# EAGLE design MJ514 - rev.1 - prod (EAGLE 9.6.2)
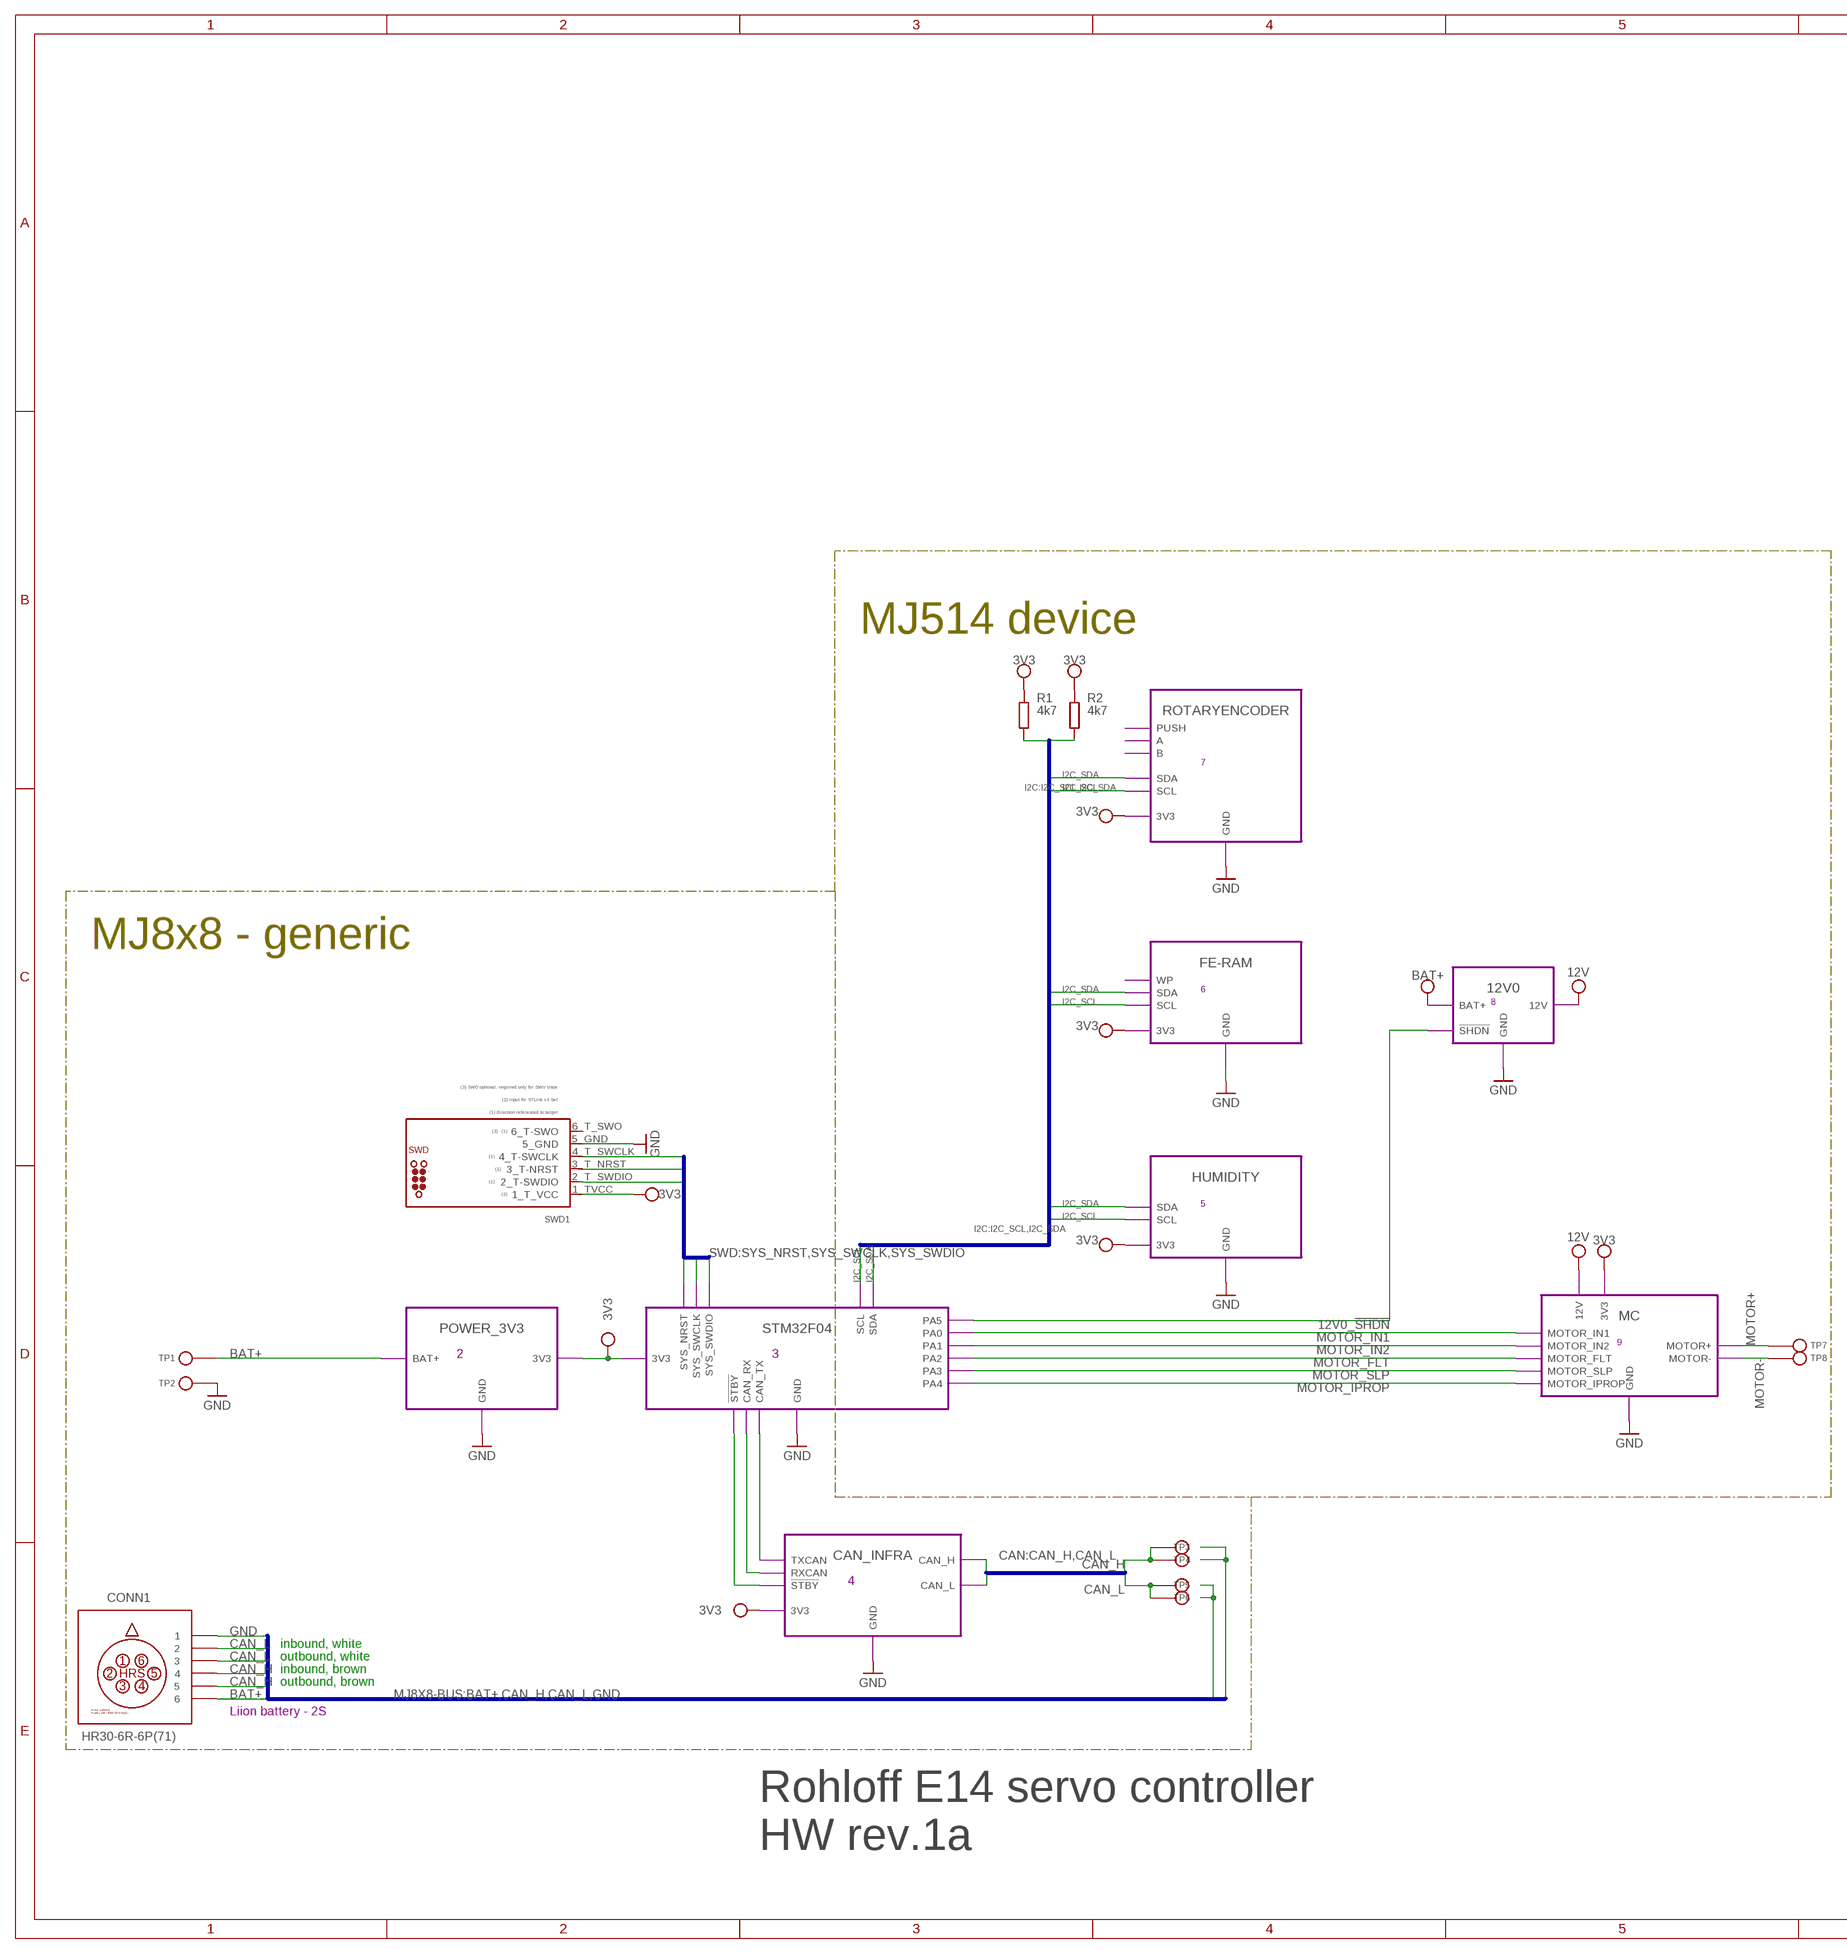
[diagram p0: schematic, sheet 1, part 1 of 2]
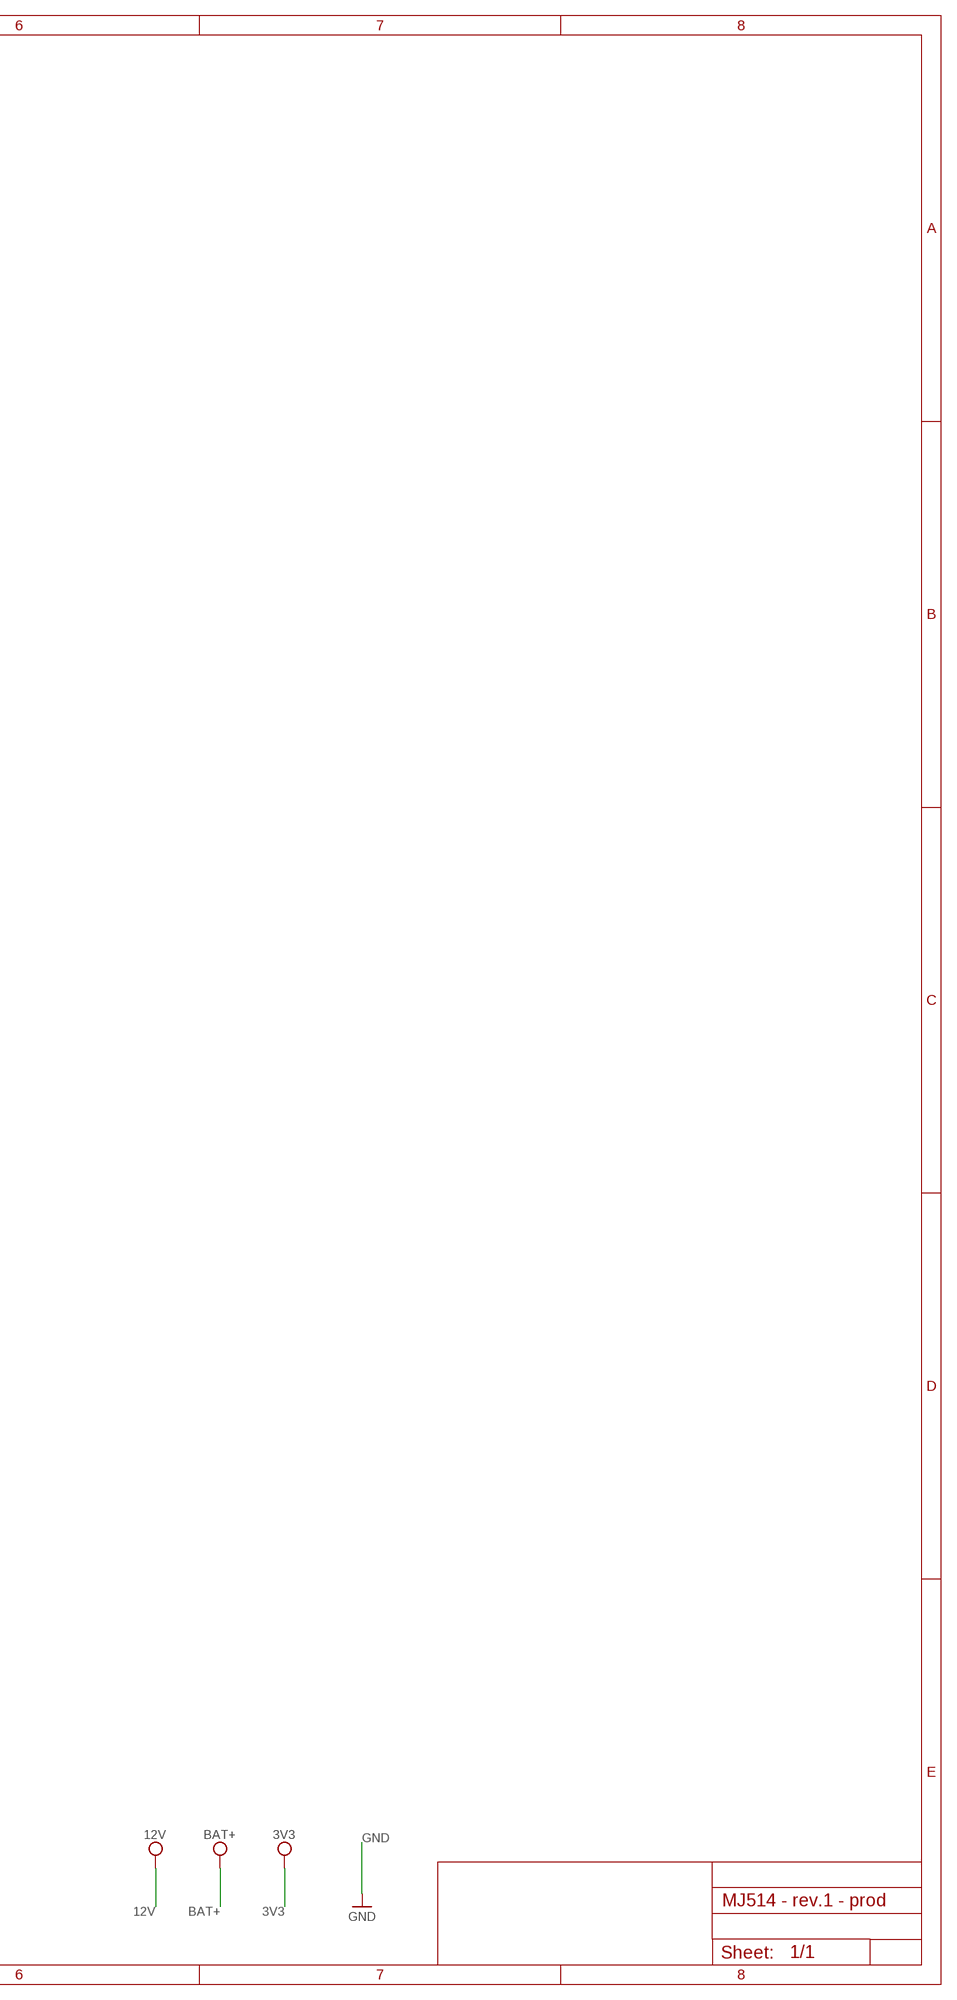
[diagram p1: schematic, sheet 1, part 2 of 2]

## Parts
CONN1  HR30-6R-6P(71)  HR-30-6R-6X  (no package)
R1  4k7  R-EU_R0402  [R0402]
R2  4k7  R-EU_R0402  [R0402]
SWD1  TC2030  [TC2030-NL]
TP1  LiIon + Terminal  TPTH-0.9  [TH-0.9]
TP2  LiIon - Terminal  TPTH-0.9  [TH-0.9]
TP3  CAN high  TPTH-0.9  [TH-0.9]
TP4  CAN high  TPTH-0.9  [TH-0.9]
TP5  CAN low  TPTH-0.9  [TH-0.9]
TP6  CAN low  TPTH-0.9  [TH-0.9]
TP7  motor +  TPTH-0.9  [TH-0.9]
TP8  motor -  TPTH-0.9  [TH-0.9]

## Module instances
POWER_3V3 = POWER_3V3 (part numbers offset by 200)
STM32F04 = STM32 (part numbers offset by 300)
CAN_INFRA = CAN_INFRA (part numbers offset by 400)
ROTARYENCODER = ROTARYENCODER (part numbers offset by 700)
FE-RAM = FE-RAM (part numbers offset by 600)
HUMIDITY = HUMIDITY (part numbers offset by 500)
12V0 = 12V0 (part numbers offset by 800)
MC = MOTOR_CONTROLLER (part numbers offset by 900)

## Nets
3V3 [3V3]: R1.2 R2.2 SWD1.1_TVCC(1_T_VCC) ; port CAN_INFRA.3V3 POWER_3V3.3V3 STM32F04.3V3 ROTARYENCODER.3V3 FE-RAM.3V3 HUMIDITY.3V3 MC.3V3
12V [12V]: port 12V0.12V MC.12V
12V0_!SHDN! [signal]: port 12V0.!SHDN! STM32F04.PA5
!STBY! [signal]: port CAN_INFRA.!STBY! STM32F04.!STBY!
BAT+ [BAT+]: CONN1.6 TP1.P$1(TP$1) ; port POWER_3V3.BAT+ 12V0.BAT+
CAN_H [signal]: CONN1.4 CONN1.5 TP3.P$1(TP$1) TP4.P$1(TP$1) ; port CAN_INFRA.CAN_H
CAN_L [signal]: CONN1.2 CONN1.3 TP5.P$1(TP$1) TP6.P$1(TP$1) ; port CAN_INFRA.CAN_L
CAN_RX [signal]: port CAN_INFRA.RXCAN STM32F04.CAN_RX
CAN_TX [signal]: port CAN_INFRA.TXCAN STM32F04.CAN_TX
GND: CONN1.1 SWD1.5_GND TP2.P$1(TP$1) ; port STM32F04.GND POWER_3V3.GND CAN_INFRA.GND FE-RAM.GND ROTARYENCODER.GND HUMIDITY.GND 12V0.GND MC.GND
I2C_SCL [signal]: R1.1 ; port STM32F04.SCL HUMIDITY.SCL FE-RAM.SCL ROTARYENCODER.SCL
I2C_SDA [signal]: R2.1 ; port STM32F04.SDA HUMIDITY.SDA FE-RAM.SDA ROTARYENCODER.SDA
MOTOR+ [motor]: TP7.P$1(TP$1) ; port MC.MOTOR+
MOTOR- [motor]: TP8.P$1(TP$1) ; port MC.MOTOR-
MOTOR_FLT [signal]: port MC.MOTOR_FLT STM32F04.PA2
MOTOR_IN1 [signal]: port MC.MOTOR_IN1 STM32F04.PA0
MOTOR_IN2 [signal]: port MC.MOTOR_IN2 STM32F04.PA1
MOTOR_IPROP [signal]: port MC.MOTOR_IPROP STM32F04.PA4
MOTOR_SLP [signal]: port MC.MOTOR_SLP STM32F04.PA3
SYS_NRST [signal]: SWD1.3_T_NRST(3_T-NRST) ; port STM32F04.SYS_NRST
SYS_SWCLK [signal]: SWD1.4_T_SWCLK(4_T-SWCLK) ; port STM32F04.SYS_SWCLK
SYS_SWDIO [signal]: SWD1.2_T_SWDIO(2_T-SWDIO) ; port STM32F04.SYS_SWDIO
Unconnected: SWD1.6_T_SWO(6_T-SWO)

## Buses
CAN:CAN_H,CAN_L
SWD:SYS_NRST,SYS_SWCLK,SYS_SWDIO
MJ8X8-BUS:BAT+,CAN_H,CAN_L,GND
I2C:I2C_SCL,I2C_SDA

## Notes on the sheet
- MJ514 device
- 7
- MJ8x8 - generic
- 6
- 8
- 5
- 9
- 2 | 3
- 4
- inbound, white
- outbound, white
- inbound, brown
- outbound, brown
- Liion battery - 2S
- Rohloff E14 servo controller
  HW rev.1a

## Library data of the parts
CONN1 = HR30-6R-6P - PushPull Receptacle:HR-30-6R-6X
R1 R2 = rcl:R-EU_: RESISTOR, European symbol; SPICEPREFIX: R
SWD1 = tag-connect:TC2030: TC2030 pad no. Function STLink v3 CN1 pin no. Function 1 Reserved (1) 2 Reserved (1) 1 T_Vcc 3 T_Vcc (2) 2 T_SWDIO 4 T_JTMS/T_SWDIO 5 GND 4 T_SWCLK 6 T_JCLK / T_SWCLK 5 GND 7 GND 6 8 T_JTDO / T_SWO (3) 9 T_JRCLK (4) / NC (5) 10 T_JTDI / NC (5) 11 GNDDetect (6) 3 T_NRST 12 T_NRST 13 T_VCP_RX (7) 14 T_VCP_TX (2) (1) Do not connect to the target (2) Input for STLINK-V3SET (3) SWO is optional, required only for Serial Wire Viewer (SWV) trace (4) Optional loopback of T_JCLK on the target side, required if loopback is removed on the STLINK-V3SET side (5) NC means not required for the SWD connection (6) Tied to GND by STLINK-V3SET firmware; may be used by the target for detection of the tool (7) Output for STLINK-V3SET
TP1-TP8 = signal testpoint:TP

## Module POWER_3V3
Ports: GND(pwr) BAT+(pwr) 3V3(pwr)
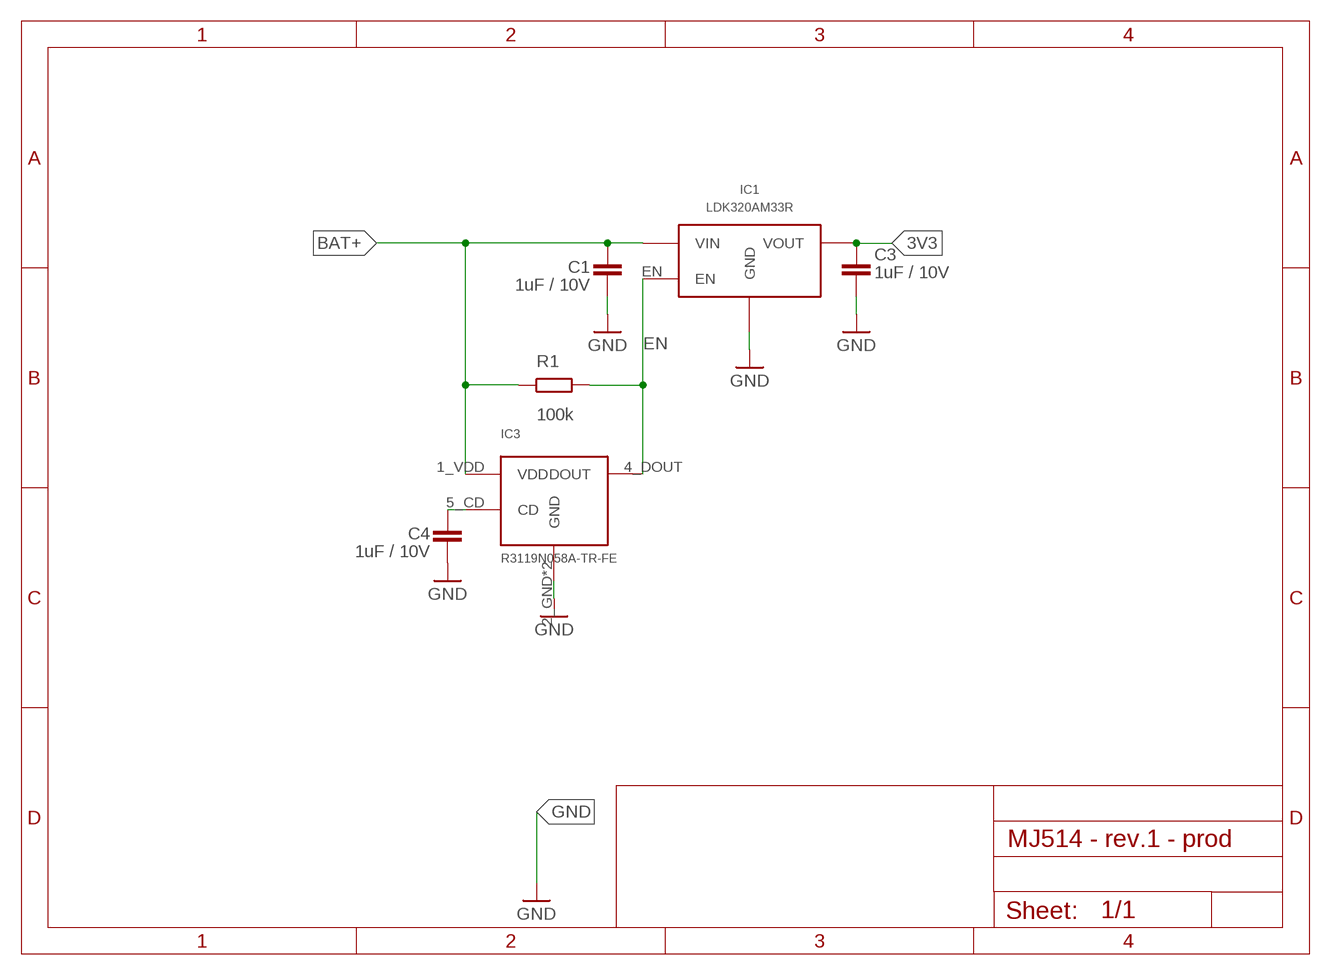
[diagram p2: schematic, module POWER_3V3, sheet 1]

### Parts
C1  1uF / 10V  C-EUC0402  [C0402]
C3  1uF / 10V  C-EUC0402  [C0402]
C4  1uF / 10V  C-EUC0402  [C0402]
IC1  LDK320AM33R  LDK320SOT-23-5L  [SOT-23-5L]
IC3  R3119N058A-TR-FE  R3119XXXA  [SOT23-5]
R1  100k  R-EU_R0402  [R0402]

### Nets
3V3 [3V3]: C3.2 IC1.OUT(VOUT)
BAT+ [BAT+]: C1.1 IC1.IN(VIN) IC3.1_VDD(VDD) R1.1
CD [signal]: C4.1 IC3.5_CD(CD)
EN [signal]: IC1.EN IC3.4_DOUT(DOUT) R1.2
GND: C1.2 C3.1 C4.2 IC1.GND IC3.2_GND(GND) IC3.3_GND(GND)

### Library data of the parts
C1 C3 C4 = rcl:C-EU: CAPACITOR, European symbol; SPICEPREFIX: C
IC1 = LDK320 5V LDO:LDK320
IC3 = R3119x - Input Voltage Detector:R3119XXXA
R1 = rcl:R-EU_: RESISTOR, European symbol; SPICEPREFIX: R

## Module STM32
Ports: GND(pwr) 3V3(pwr) SYS_NRST(in) SYS_SWCLK(io) SYS_SWDIO(io) CAN_RX(in) CAN_TX(out) !STBY!(out) SCL(out) SDA(io) PA0(out) PA1(out) PA2(in) PA3(out) PA4(in) PA5(out)
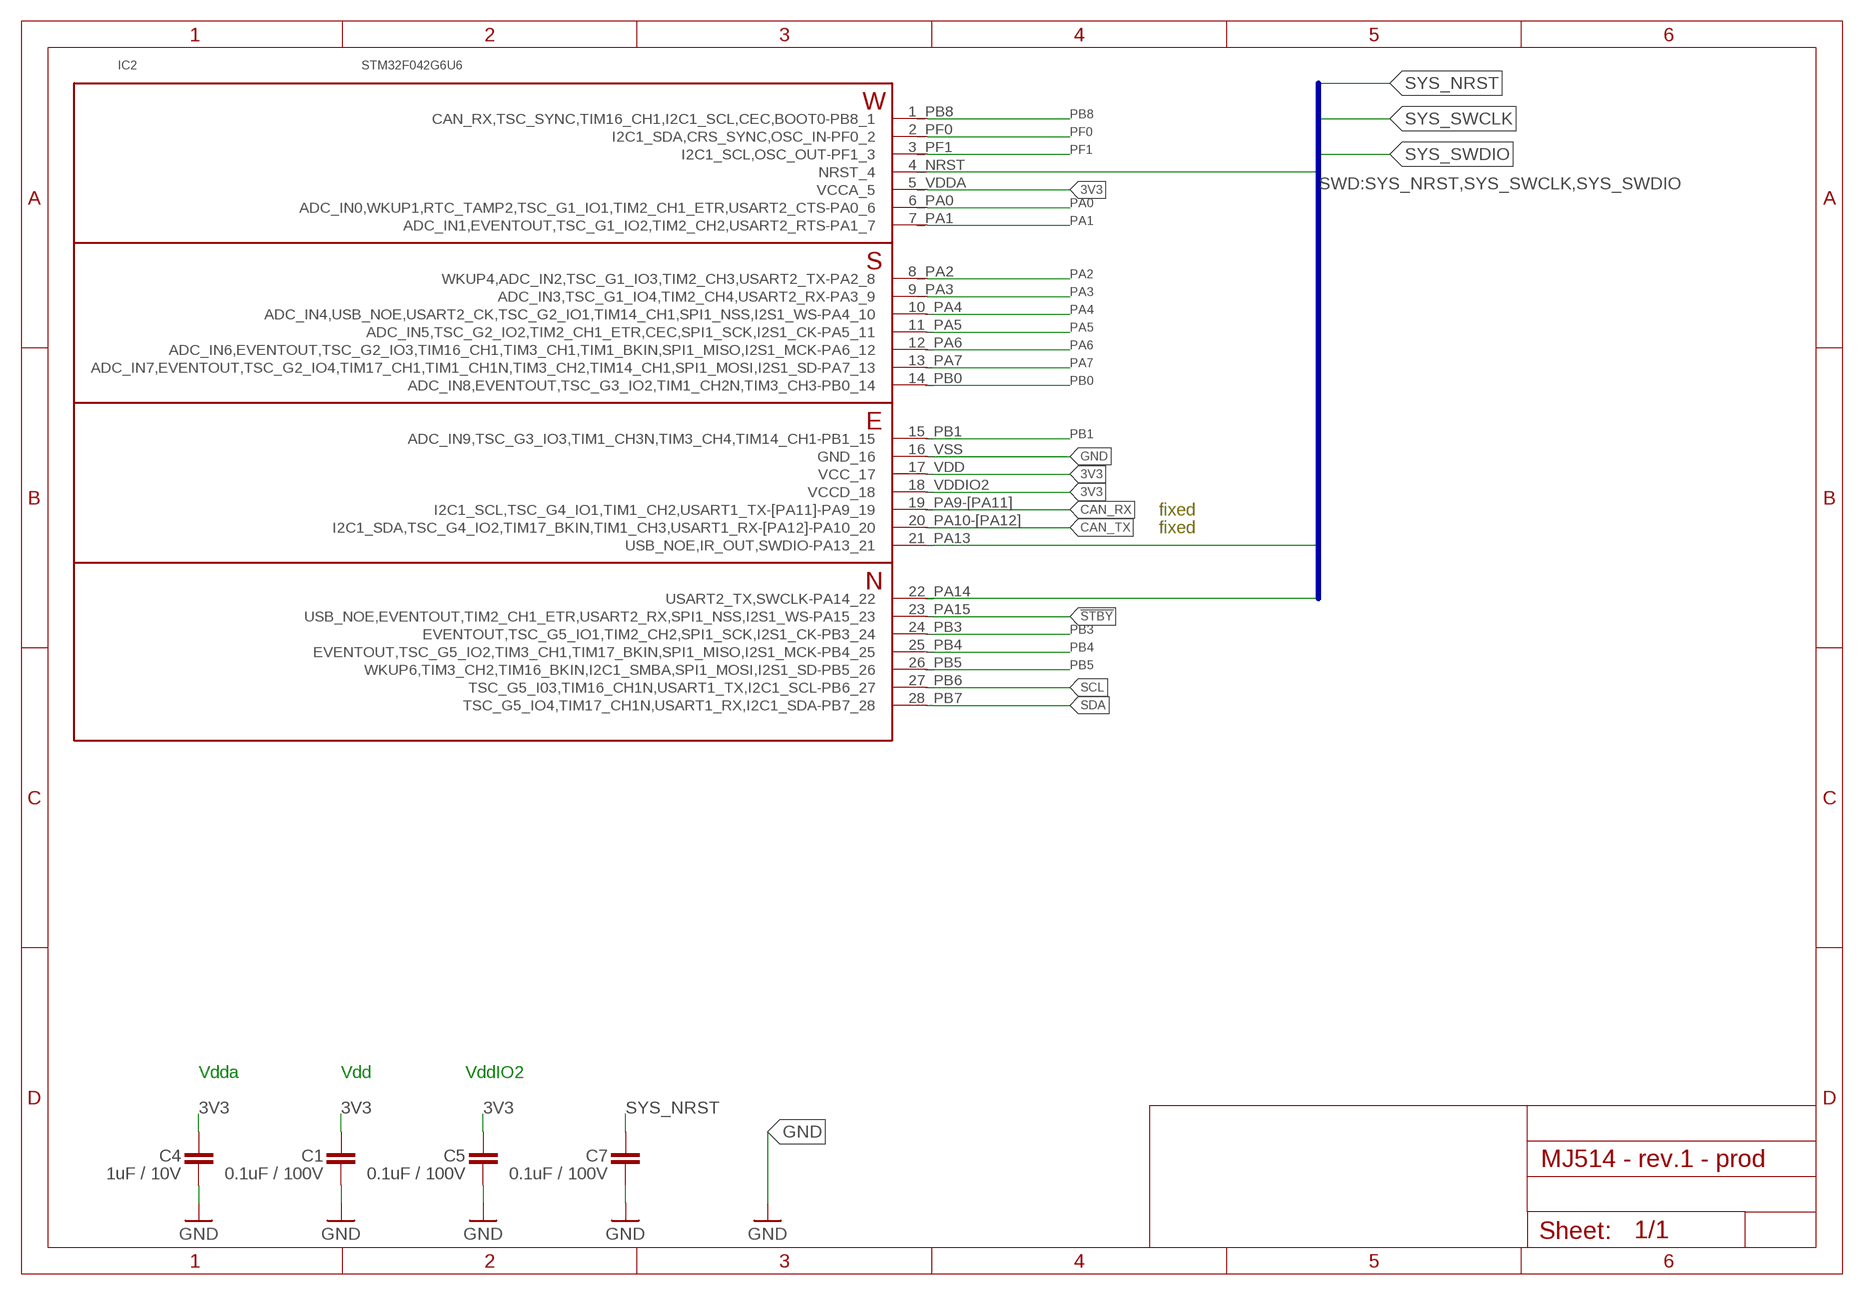
[diagram p3: schematic, module STM32, sheet 1]

### Parts
C1  0.1uF / 100V  C-EUC0402  [C0402]
C4  1uF / 10V  C-EUC0402  [C0402]
C5  0.1uF / 100V  C-EUC0402  [C0402]
C7  0.1uF / 100V  C-EUC0402  [C0402]
IC2  STM32F042G6U6  STM32F042G6  [UFQFPN-28]

### Nets
3V3 [3V3]: C1.2 C4.2 C5.2 IC2.5_VDDA(VCCA_5) IC2.17_VDD(VCC_17) IC2.18_VDDIO2(VCCD_18)
!STBY! [signal]: IC2.23_PA15(USB_NOE,EVENTOUT,TIM2_CH1_ETR,USART2_RX,SPI1_NSS,I2S1_WS-PA15_23)
CAN_RX [signal]: IC2.19_PA9-[PA11](I2C1_SCL,TSC_G4_IO1,TIM1_CH2,USART1_TX-[PA11]-PA9_19)
CAN_TX [signal]: IC2.20_PA10-[PA12](I2C1_SDA,TSC_G4_IO2,TIM17_BKIN,TIM1_CH3,USART1_RX-[PA12]-PA10_20)
GND: C1.1 C4.1 C5.1 C7.1 IC2.16_VSS(GND_16)
PA0 [signal]: IC2.6_PA0(ADC_IN0,WKUP1,RTC_TAMP2,TSC_G1_IO1,TIM2_CH1_ETR,USART2_CTS-PA0_6)
PA1 [signal]: IC2.7_PA1(ADC_IN1,EVENTOUT,TSC_G1_IO2,TIM2_CH2,USART2_RTS-PA1_7)
PA2 [signal]: IC2.8_PA2(WKUP4,ADC_IN2,TSC_G1_IO3,TIM2_CH3,USART2_TX-PA2_8)
PA3 [signal]: IC2.9_PA3(ADC_IN3,TSC_G1_IO4,TIM2_CH4,USART2_RX-PA3_9)
PA4 [signal]: IC2.10_PA4(ADC_IN4,USB_NOE,USART2_CK,TSC_G2_IO1,TIM14_CH1,SPI1_NSS,I2S1_WS-PA4_10)
PA5 [signal]: IC2.11_PA5(ADC_IN5,TSC_G2_IO2,TIM2_CH1_ETR,CEC,SPI1_SCK,I2S1_CK-PA5_11)
PA6 [signal]: IC2.12_PA6(ADC_IN6,EVENTOUT,TSC_G2_IO3,TIM16_CH1,TIM3_CH1,TIM1_BKIN,SPI1_MISO,I2S1_MCK-PA6_12)
PA7 [signal]: IC2.13_PA7(ADC_IN7,EVENTOUT,TSC_G2_IO4,TIM17_CH1,TIM1_CH1N,TIM3_CH2,TIM14_CH1,SPI1_MOSI,I2S1_SD-PA7_13)
PB0 [signal]: IC2.14_PB0(ADC_IN8,EVENTOUT,TSC_G3_IO2,TIM1_CH2N,TIM3_CH3-PB0_14)
PB1 [signal]: IC2.15_PB1(ADC_IN9,TSC_G3_IO3,TIM1_CH3N,TIM3_CH4,TIM14_CH1-PB1_15)
PB3 [signal]: IC2.24_PB3(EVENTOUT,TSC_G5_IO1,TIM2_CH2,SPI1_SCK,I2S1_CK-PB3_24)
PB4 [signal]: IC2.25_PB4(EVENTOUT,TSC_G5_IO2,TIM3_CH1,TIM17_BKIN,SPI1_MISO,I2S1_MCK-PB4_25)
PB5 [signal]: IC2.26_PB5(WKUP6,TIM3_CH2,TIM16_BKIN,I2C1_SMBA,SPI1_MOSI,I2S1_SD-PB5_26)
PB8 [signal]: IC2.1_PB8(CAN_RX,TSC_SYNC,TIM16_CH1,I2C1_SCL,CEC,BOOT0-PB8_1)
PF0 [signal]: IC2.2_PF0(I2C1_SDA,CRS_SYNC,OSC_IN-PF0_2)
PF1 [signal]: IC2.3_PF1(I2C1_SCL,OSC_OUT-PF1_3)
SCL [signal]: IC2.27_PB6(TSC_G5_I03,TIM16_CH1N,USART1_TX,I2C1_SCL-PB6_27)
SDA [signal]: IC2.28_PB7(TSC_G5_IO4,TIM17_CH1N,USART1_RX,I2C1_SDA-PB7_28)
SYS_NRST [signal]: C7.2 IC2.4_NRST(NRST_4)
SYS_SWCLK [signal]: IC2.22_PA14(USART2_TX,SWCLK-PA14_22)
SYS_SWDIO [signal]: IC2.21_PA13(USB_NOE,IR_OUT,SWDIO-PA13_21)

### Buses
SWD:SYS_NRST,SYS_SWCLK,SYS_SWDIO

### Notes on the sheet
- fixed
- fixed
- Vdda | Vdd | VddIO2

### Library data of the parts
C1 C4 C5 C7 = rcl:C-EU: CAPACITOR, European symbol; SPICEPREFIX: C
IC2 = STM32F042G6:STM32F042G6

## Module CAN_INFRA
Ports: GND(pwr) 3V3(pwr) CAN_H(io) CAN_L(io) TXCAN(in) RXCAN(out) !STBY!(in)
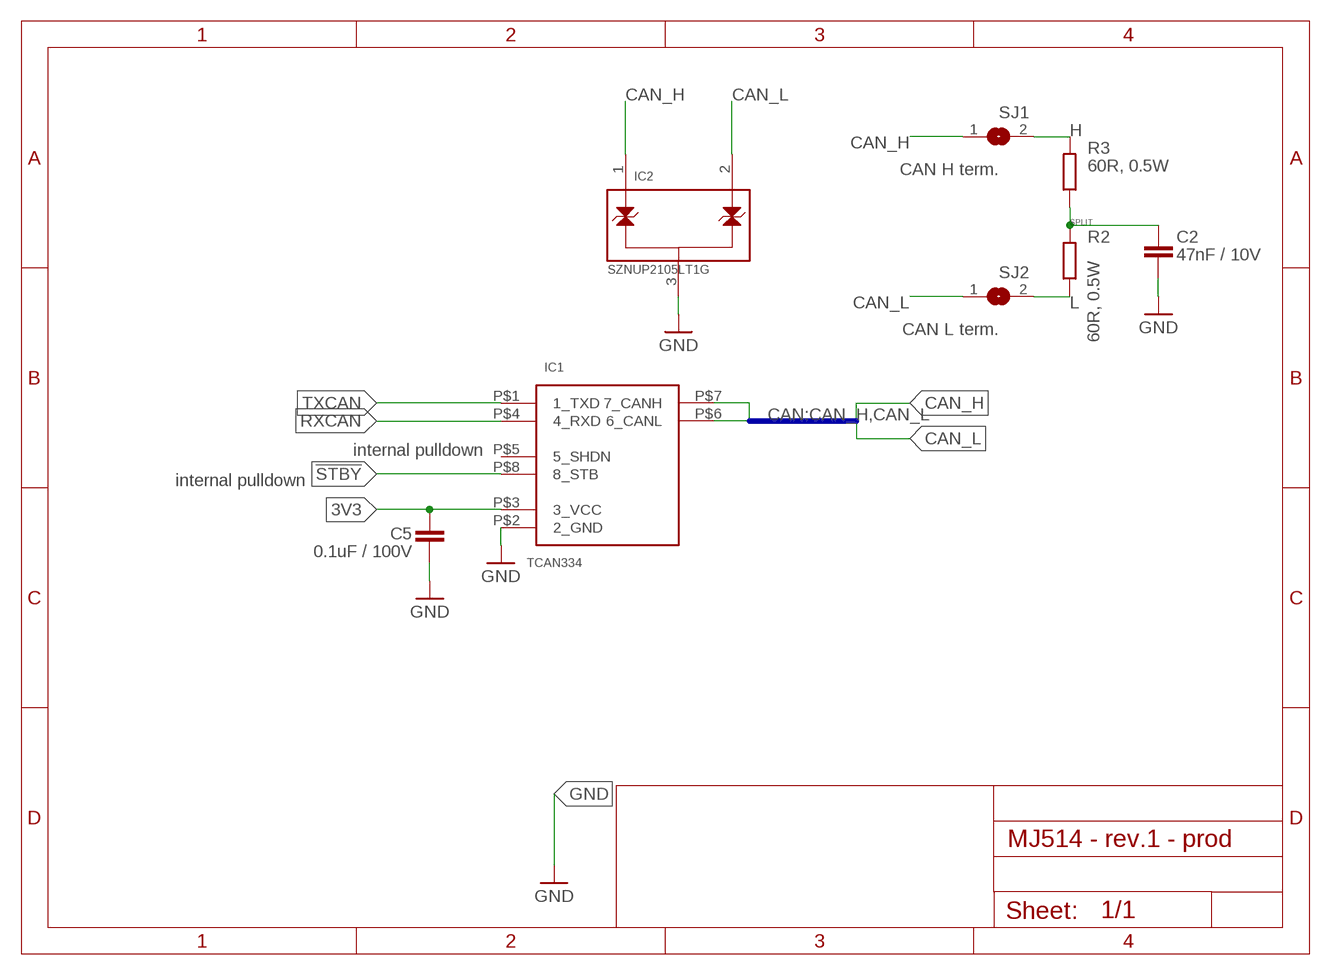
[diagram p4: schematic, module CAN_INFRA, sheet 1]

### Parts
C2  47nF / 10V  C-EUC0402  [C0402]
C5  0.1uF / 100V  C-EUC0402  [C0402]
IC1  TCAN334  CAN33X  [SOT23-8]
IC2  SZNUP2105LT1G  NUP2105L  [SOT-23-3]
R2  60R, 0.5W  R-EU_R0805  [R0805]
R3  60R, 0.5W  R-EU_R0805  [R0805]
SJ1  CAN H term.  SJ  [SJ]
SJ2  CAN L term.  SJ  [SJ]

### Nets
3V3 [3V3]: C5.1 IC1.P$3(3_VCC)
!STBY! [signal]: IC1.P$8(8_STB)
CAN_H [signal]: IC1.P$7(7_CANH) IC2.1(PIN1) SJ1.1
CAN_L [signal]: IC1.P$6(6_CANL) IC2.2(PIN2) SJ2.1
GND: C2.2 C5.2 IC1.P$2(2_GND) IC2.3(PIN3)
H [signal]: R3.2 SJ1.2
L [signal]: R2.1 SJ2.2
RXCAN [signal]: IC1.P$4(4_RXD)
SPLIT [signal]: C2.1 R2.2 R3.1
TXCAN [signal]: IC1.P$1(1_TXD)
Unconnected: IC1.P$5(5_SHDN)

### Buses
CAN:CAN_H,CAN_L

### Notes on the sheet
- internal pulldown
- internal pulldown

### Library data of the parts
C2 C5 = rcl:C-EU: CAPACITOR, European symbol; SPICEPREFIX: C
IC1 = TCAN33x - 3.3V CAN Transciever:CAN33X
IC2 = NUP2105L - 27V ESD Protection Diode:NUP2105L
R2 R3 = rcl:R-EU_: RESISTOR, European symbol; SPICEPREFIX: R
SJ1 SJ2 = jumper:SJ: SMD solder JUMPER

## Module ROTARYENCODER
Ports: GND(pwr) 3V3(pwr) A(out) B(out) PUSH(out) SCL(in) SDA(io)
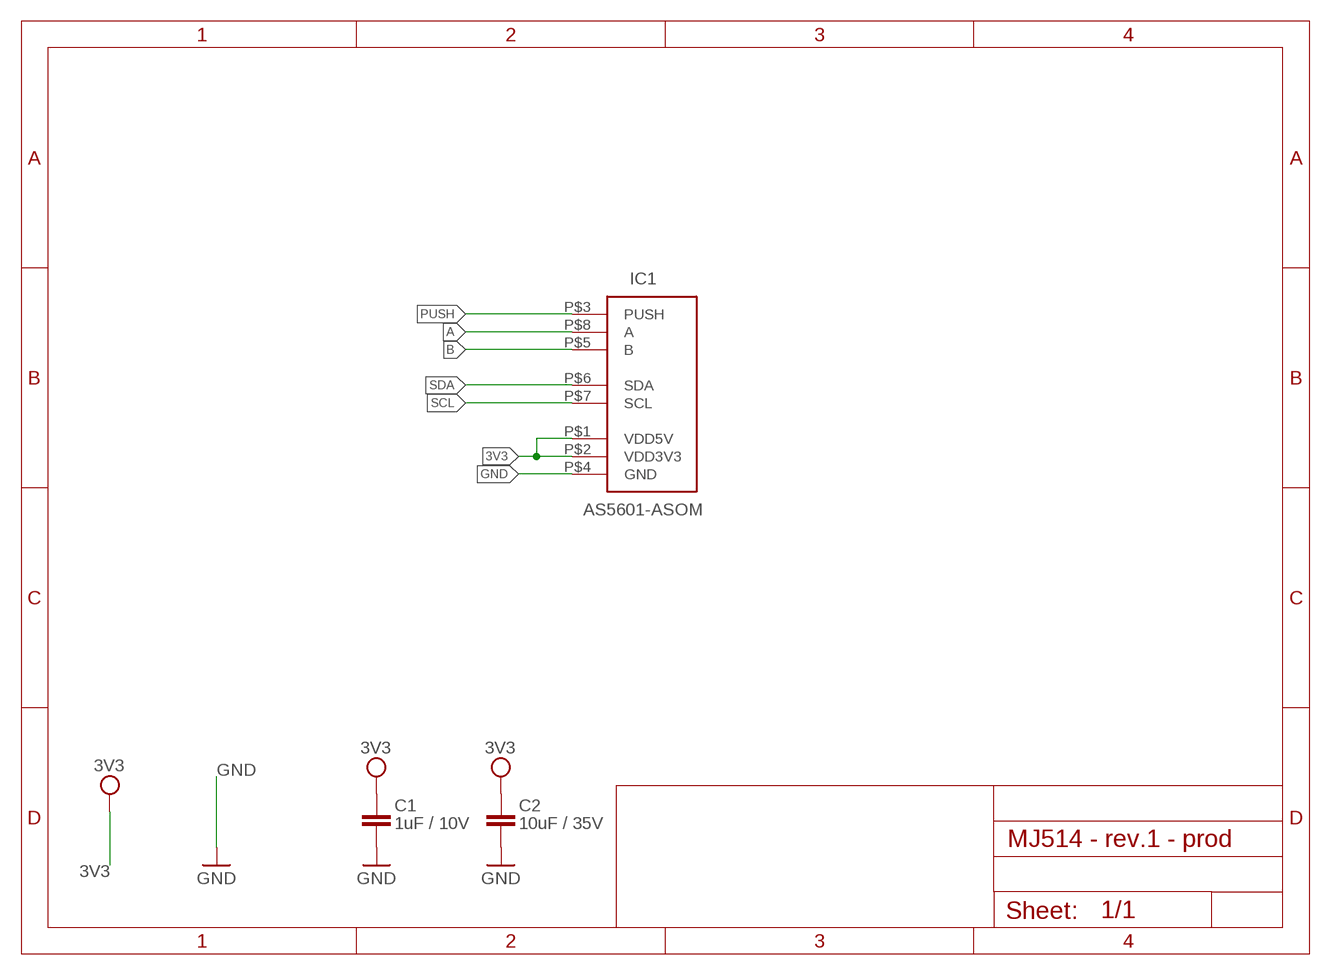
[diagram p5: schematic, module ROTARYENCODER, sheet 1]

### Parts
C1  1uF / 10V  C-EUC0402  [C0402]
C2  10uF / 35V  C-EUC0603  [C0603]
IC1  AS5601-ASOM  AS5601  [SOIC8]

### Nets
3V3 [3V3]: C1.1 C2.1 IC1.P$1(VDD5V) IC1.P$2(VDD3V3)
A [signal]: IC1.P$8(A)
B [signal]: IC1.P$5(B)
GND: C1.2 C2.2 IC1.P$4(GND)
PUSH [signal]: IC1.P$3(PUSH)
SCL [signal]: IC1.P$7(SCL)
SDA [signal]: IC1.P$6(SDA)

### Library data of the parts
C1 C2 = rcl:C-EU: CAPACITOR, European symbol; SPICEPREFIX: C
IC1 = AS5601 - Programmable Contactless Encoder:AS5601

## Module FE-RAM
Ports: GND(pwr) 3V3(pwr) WP(hiz) SCL(in) SDA(io)
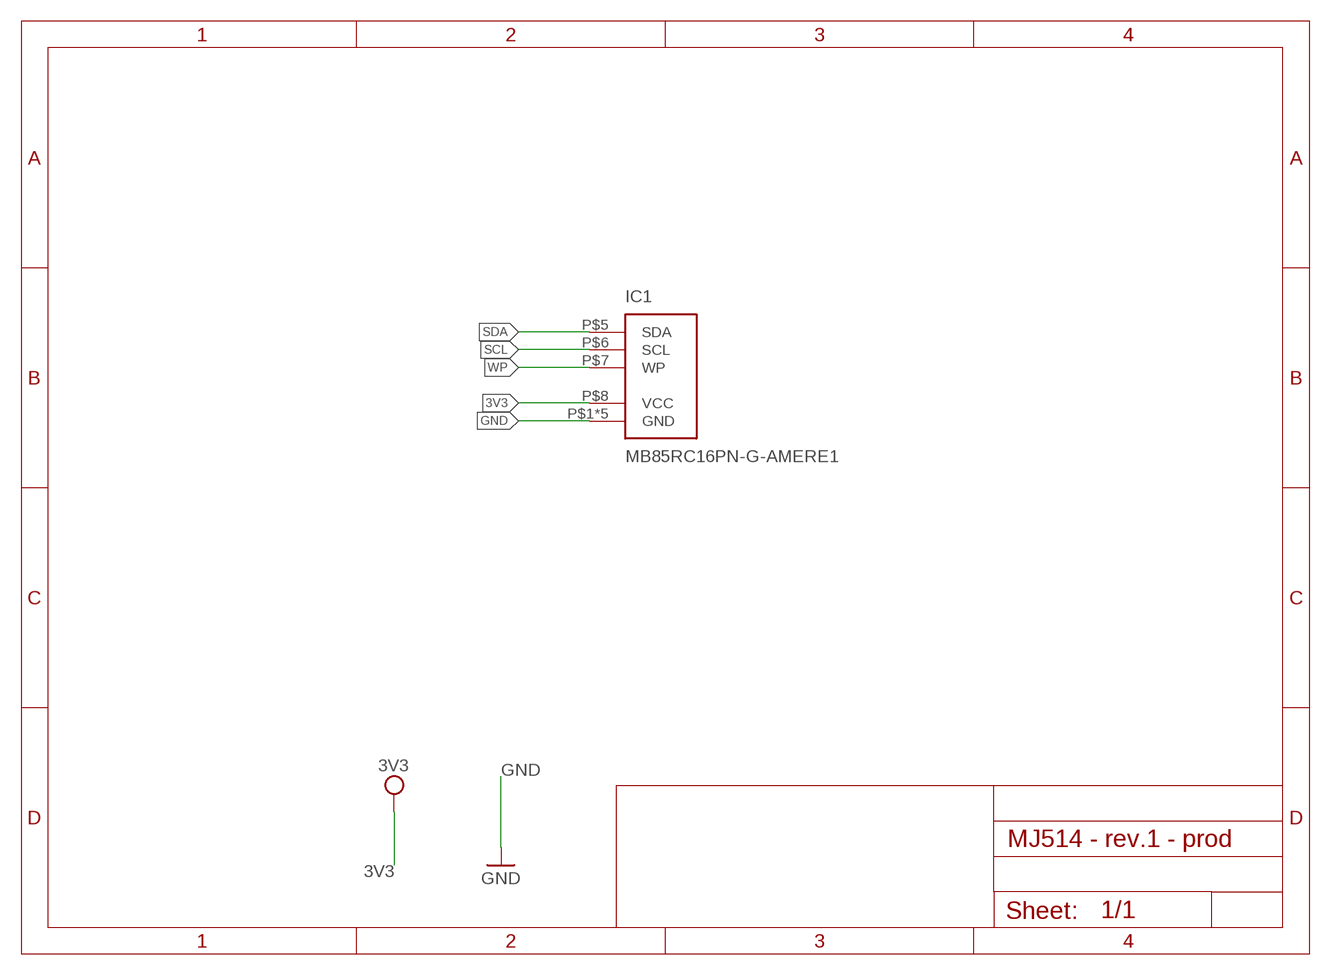
[diagram p6: schematic, module FE-RAM, sheet 1]

### Parts
IC1  MB85RC16PN-G-AMERE1  MB85RC  [SON-8]

### Nets
3V3 [3V3]: IC1.P$8(VCC)
GND: IC1.P$1(GND) IC1.P$2(GND) IC1.P$3(GND) IC1.P$4(GND) IC1.P$9(GND)
SCL [signal]: IC1.P$6(SCL)
SDA [signal]: IC1.P$5(SDA)
WP [signal]: IC1.P$7(WP)

### Library data of the parts
IC1 = MB85RC - FeRAM, I2C:MB85RC

## Module HUMIDITY
Ports: GND(pwr) 3V3(pwr) SCL(in) SDA(io)
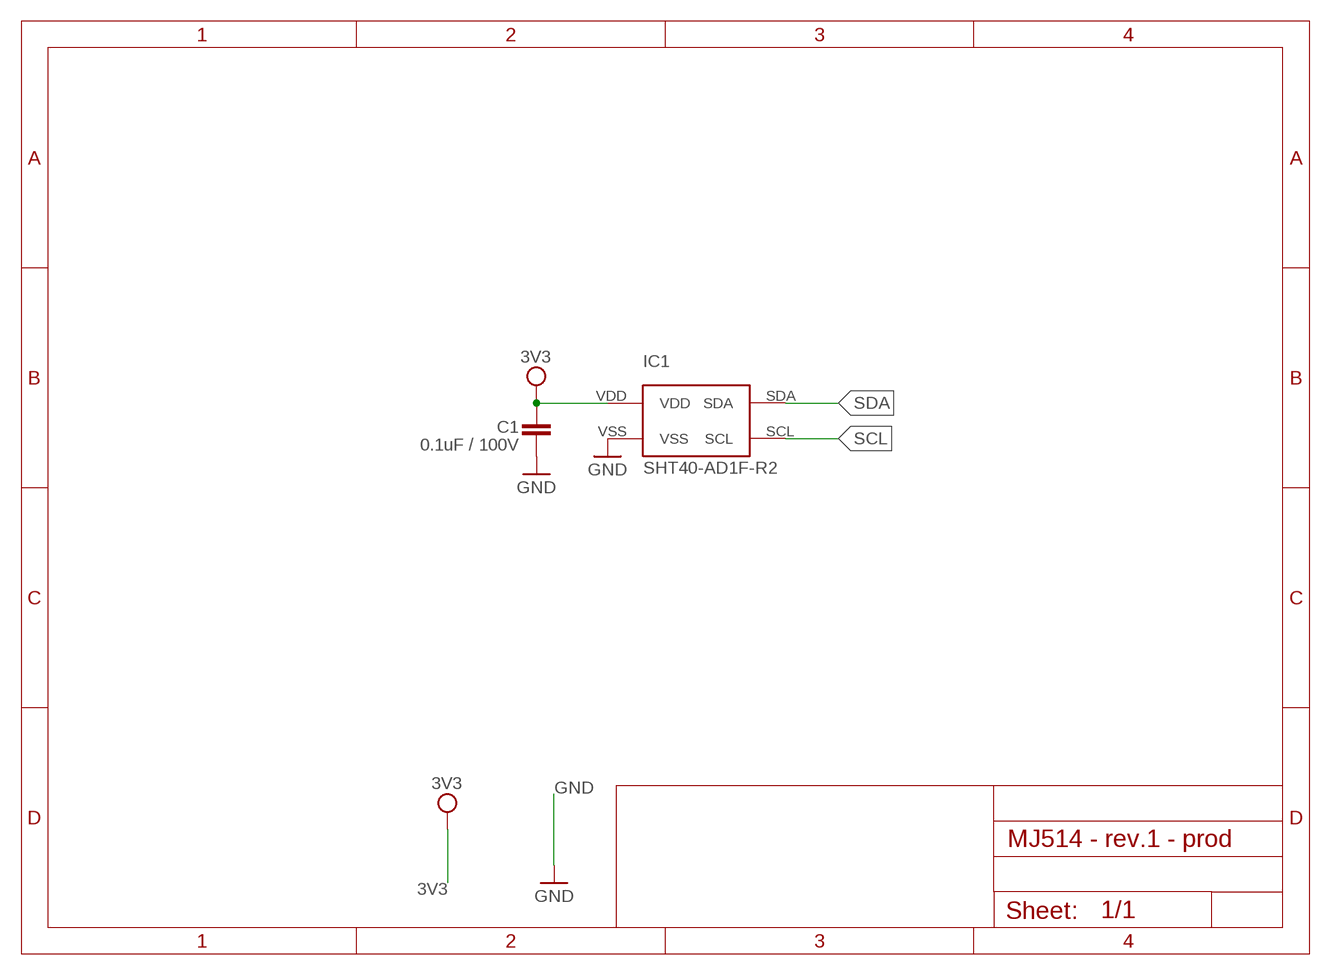
[diagram p7: schematic, module HUMIDITY, sheet 1]

### Parts
C1  0.1uF / 100V  C-EUC0402  [C0402]
IC1  SHT40-AD1F-R2  SHT40  [SMD]

### Nets
3V3 [3V3]: C1.1 IC1.VDD
GND: C1.2 IC1.VSS
SCL [signal]: IC1.SCL
SDA [signal]: IC1.SDA

### Library data of the parts
C1 = rcl:C-EU: CAPACITOR, European symbol; SPICEPREFIX: C
IC1 = SHT40-AD1F - Humidity Sensor:SHT40

## Module 12V0
Ports: GND(pwr) 12V(pwr) BAT+(pwr) !SHDN!(in)
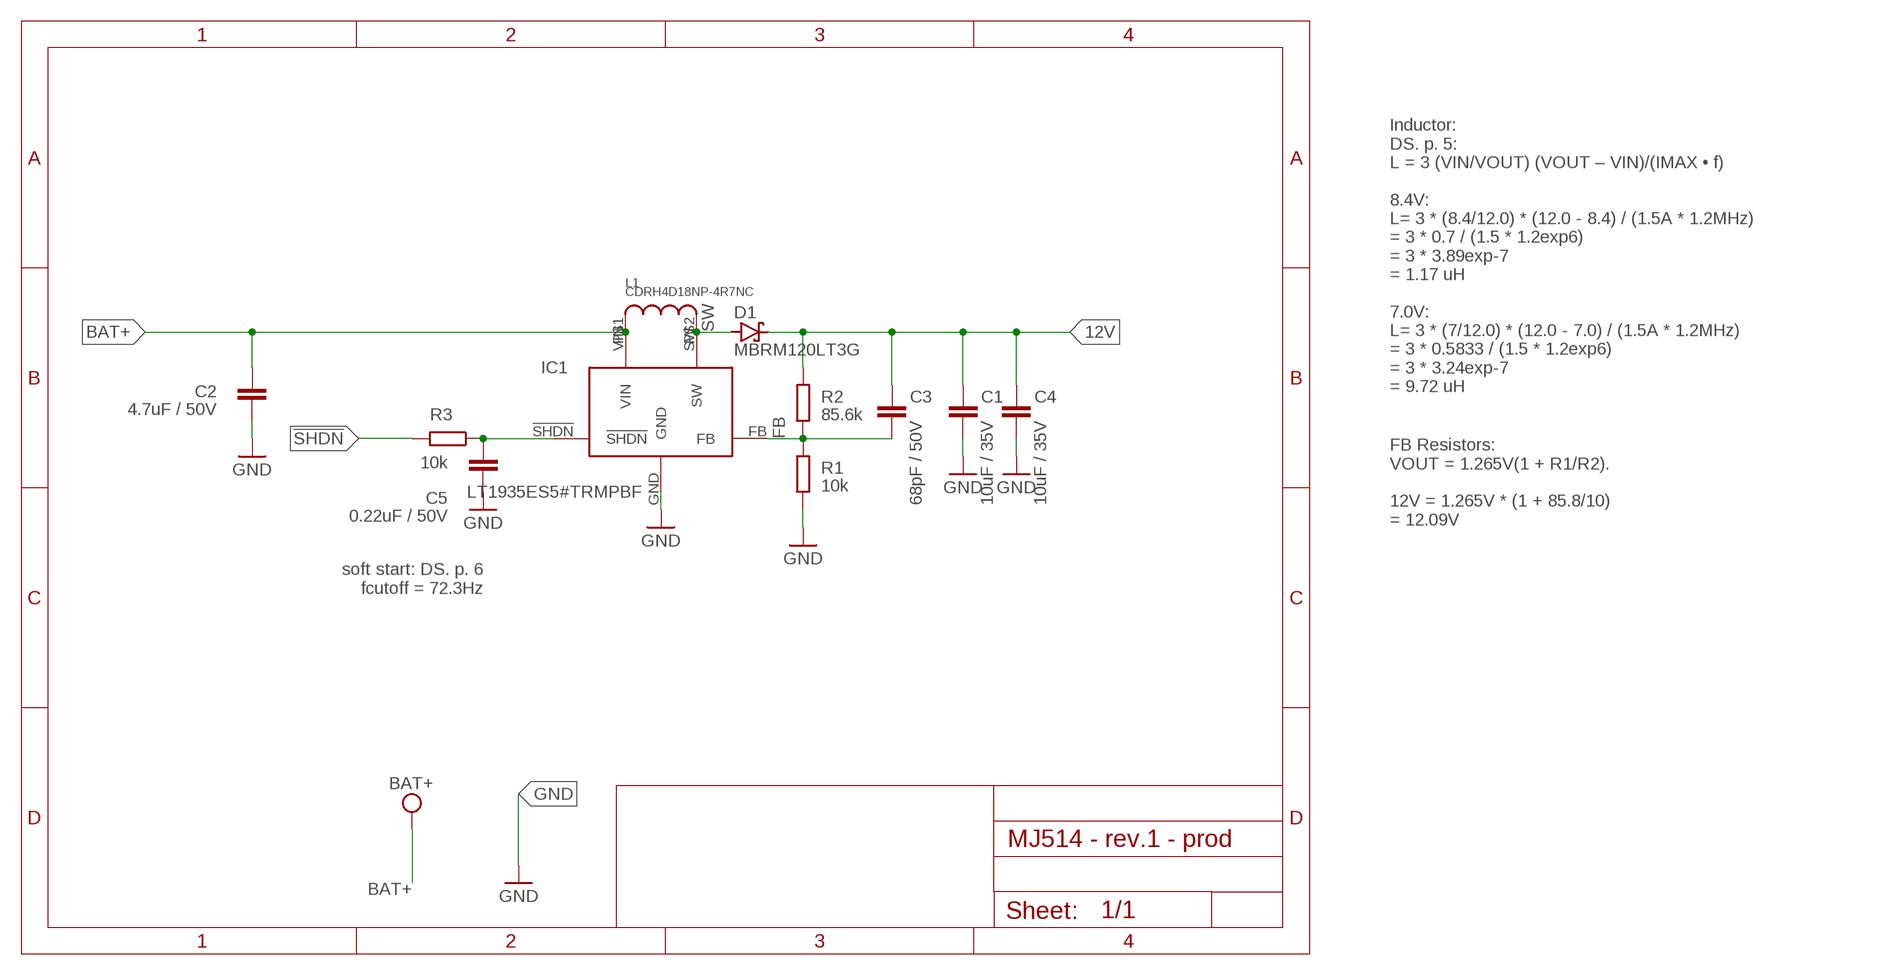
[diagram p8: schematic, module 12V0, sheet 1]

### Parts
C1  10uF / 35V  C-EUC0603  [C0603]
C2  4.7uF / 50V  C-EUC0603  [C0603]
C3  68pF / 50V  C-EUC0402  [C0402]
C4  10uF / 35V  C-EUC0603  [C0603]
C5  0.22uF / 50V  C-EUC0402  [C0402]
D1  MBRM120LT3G  SCHOTTKY-DIODESMD  [SMB]
IC1  LT1935ES5#TRMPBF  LT1935  [TSOT-23-5]
L1  CDRH4D18NP-4R7NC  CDRH4D18  [5050]
R1  10k  R-EU_R0402  [R0402]
R2  85.6k  R-EU_R0603  [R0603]
R3  10k  R-EU_R0402  [R0402]

### Nets
12V [12V]: C1.1 C3.1 C4.1 D1.C R2.2
!SHDN! [signal]: R3.2
!SHDN!_IN [signal]: C5.1 IC1.!SHDN! R3.1
BAT+ [BAT+]: C2.2 IC1.VIN L1.P$1
FB [signal]: C3.2 IC1.FB R1.2 R2.1
GND: C1.2 C2.1 C4.2 C5.2 IC1.GND R1.1
SW [12V]: D1.A IC1.SW L1.P$2

### Notes on the sheet
- Inductor:
  DS. p. 5:
  L = 3 (VIN/VOUT) (VOUT – VIN)/(IMAX • f)
  
  8.4V:
  L= 3 * (8.4/12.0) * (12.0 - 8.4) / (1.5A * 1.2MHz)
  = 3 * 0.7 / (1.5 * 1.2exp6)
  = 3 * 3.89exp-7
  = 1.17 uH
  
  7.0V:
  L= 3 * (7/12.0) * (12.0 - 7.0) / (1.5A * 1.2MHz)
  = 3 * 0.5833 / (1.5 * 1.2exp6)
  = 3 * 3.24exp-7
  = 9.72 uH
- FB Resistors:
  VOUT = 1.265V(1 + R1/R2).
  
  12V = 1.265V * (1 + 85.8/10)
  = 12.09V
- soft start: DS. p. 6
  fcutoff = 72.3Hz

### Library data of the parts
C1-C5 = rcl:C-EU: CAPACITOR, European symbol; SPICEPREFIX: C
D1 = diode:SCHOTTKY-DIODE: Schottky Diode
IC1 = LTC1935 - Boost DC-DC Converter:LT1935
L1 = CDRH4D18 - Power Inductor:CDRH4D18
R1-R3 = rcl:R-EU_: RESISTOR, European symbol; SPICEPREFIX: R

## Module MOTOR_CONTROLLER
Ports: MOTOR+(out) MOTOR-(out) GND(pwr) 3V3(pwr) MOTOR_IN1(in) MOTOR_IN2(in) MOTOR_FLT(out) MOTOR_SLP(in) MOTOR_IPROP(out) 12V(pwr)
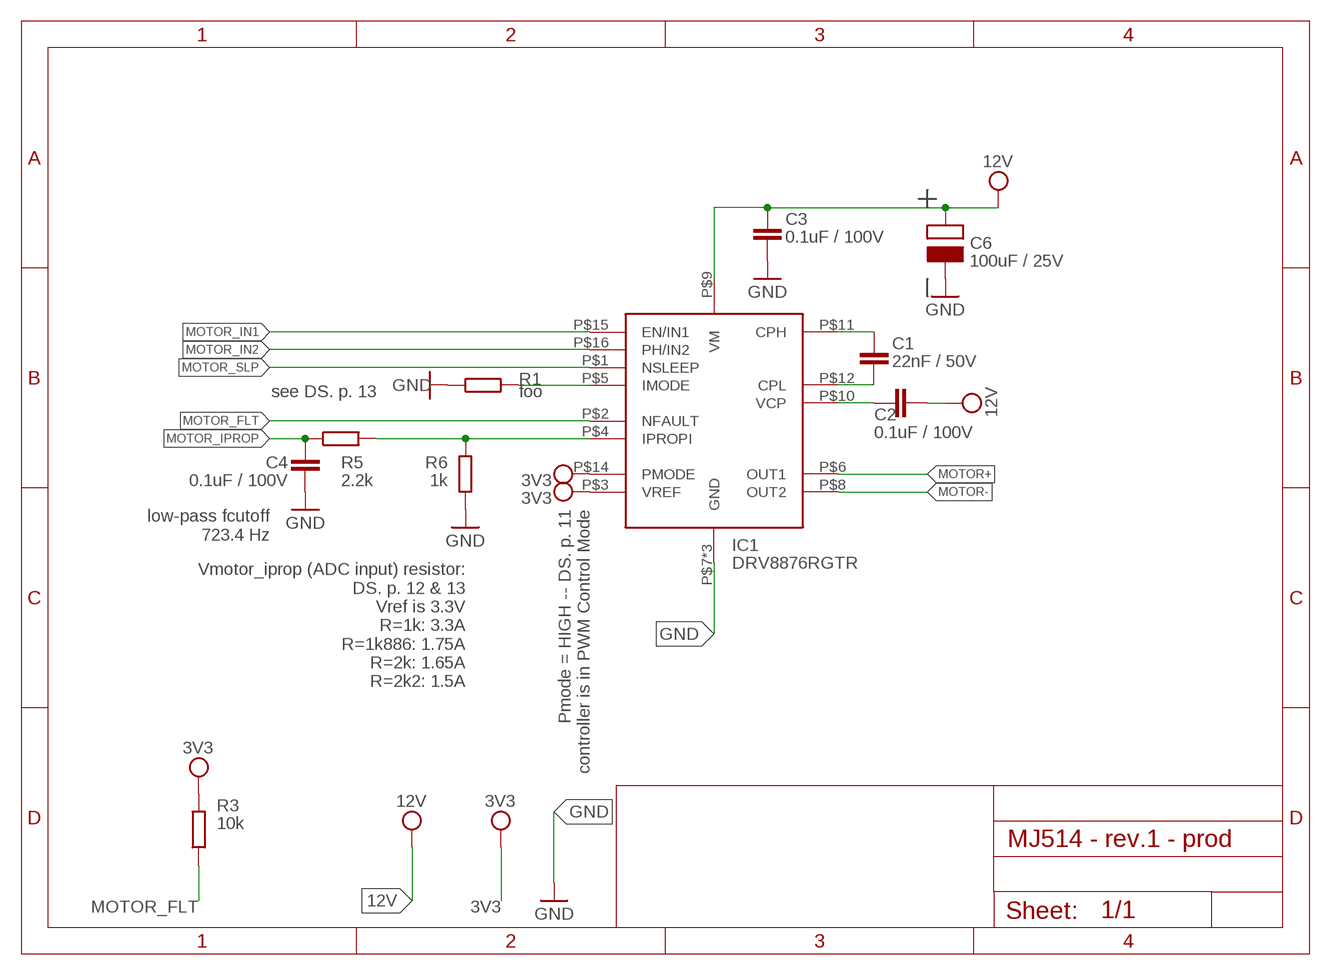
[diagram p9: schematic, module MOTOR_CONTROLLER, sheet 1]

### Parts
C1  22nF / 50V  C-EUC0402  [C0402]
C2  0.1uF / 100V  C-EUC0402  [C0402]
C3  0.1uF / 100V  C-EUC0402  [C0402]
C4  0.1uF / 100V  C-EUC0402  [C0402]
C6  100uF / 25V  C-POL  [TH]
IC1  DRV8876RGTR  DRV8876  [VQFN16]
R1  foo  R-EU_R0402  [R0402]
R3  10k  R-EU_R0402  [R0402]
R5  2.2k  R-EU_R0402  [R0402]
R6  1k  R-EU_R0402  [R0402]

### Nets
3V3 [3V3]: IC1.P$3(VREF) IC1.P$14(PMODE) R3.2
12V [12V]: C2.2 C3.2 C6.POS IC1.P$9(VM)
CPH [signal]: C1.1 IC1.P$11(CPH)
CPL [signal]: C1.2 IC1.P$12(CPL)
GND: C3.1 C4.2 C6.NEG IC1.P$7(GND) IC1.P$13(GND) IC1.P$17(GND) R1.1 R6.1
IMODE [signal]: IC1.P$5(IMODE) R1.2
IPROPI [signal]: IC1.P$4(IPROPI) R5.2 R6.2
MOTOR+ [12V]: IC1.P$6(OUT1)
MOTOR- [12V]: IC1.P$8(OUT2)
MOTOR_FLT [signal]: IC1.P$2(NFAULT) R3.1
MOTOR_IN1 [signal]: IC1.P$15(EN/IN1)
MOTOR_IN2 [signal]: IC1.P$16(PH/IN2)
MOTOR_IPROP [signal]: C4.1 R5.1
MOTOR_SLP [signal]: IC1.P$1(NSLEEP)
VCP [signal]: C2.1 IC1.P$10(VCP)

### Notes on the sheet
- see DS. p. 13
- low-pass fcutoff
  723.4 Hz
- Pmode = HIGH -- DS. p. 11
  controller is in PWM Control Mode
- Vmotor_iprop (ADC input) resistor:
  DS. p. 12 & 13
  Vref is 3.3V
  R=1k: 3.3A
  R=1k886: 1.75A
  R=2k: 1.65A
  R=2k2: 1.5A

### Library data of the parts
C1-C4 = rcl:C-EU: CAPACITOR, European symbol; SPICEPREFIX: C
C6 = C-Pol:C-POL
IC1 = DRV8876 - H-Bridge Motor Driver:DRV8876
R1 R3 R5 R6 = rcl:R-EU_: RESISTOR, European symbol; SPICEPREFIX: R

## Net classes
0 GND: width 0.25 mm, drill 0.35 mm, clearance 0.19 mm
1 BAT+: width 0.5 mm, drill 0.35 mm, clearance 0.19 mm
2 12V: width 0.5 mm, drill 0.35 mm, clearance 0.19 mm
3 signal: width 0.25 mm, drill 0.35 mm, clearance 0.19 mm
4 3V3: width 0.25 mm, drill 0.35 mm, clearance 0.19 mm
5 motor: width 0.25 mm, drill 0.35 mm, clearance 0.19 mm

## Board
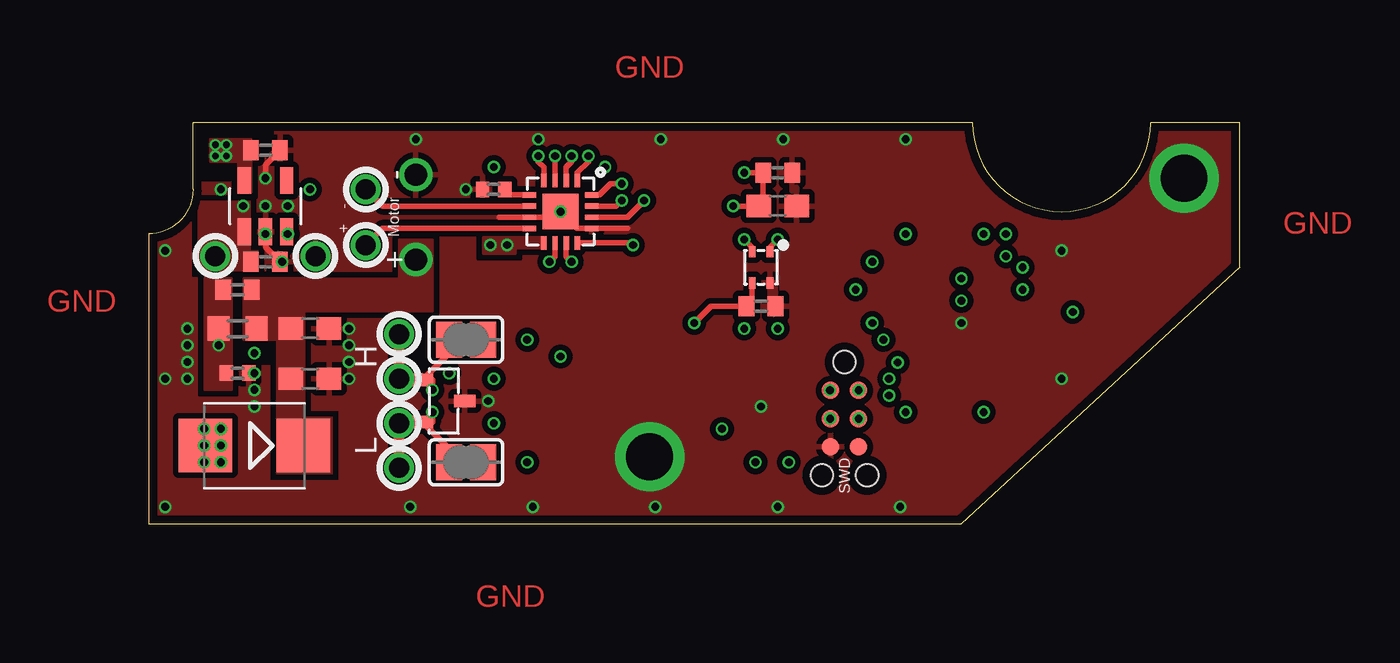
[diagram p10: board, top side]
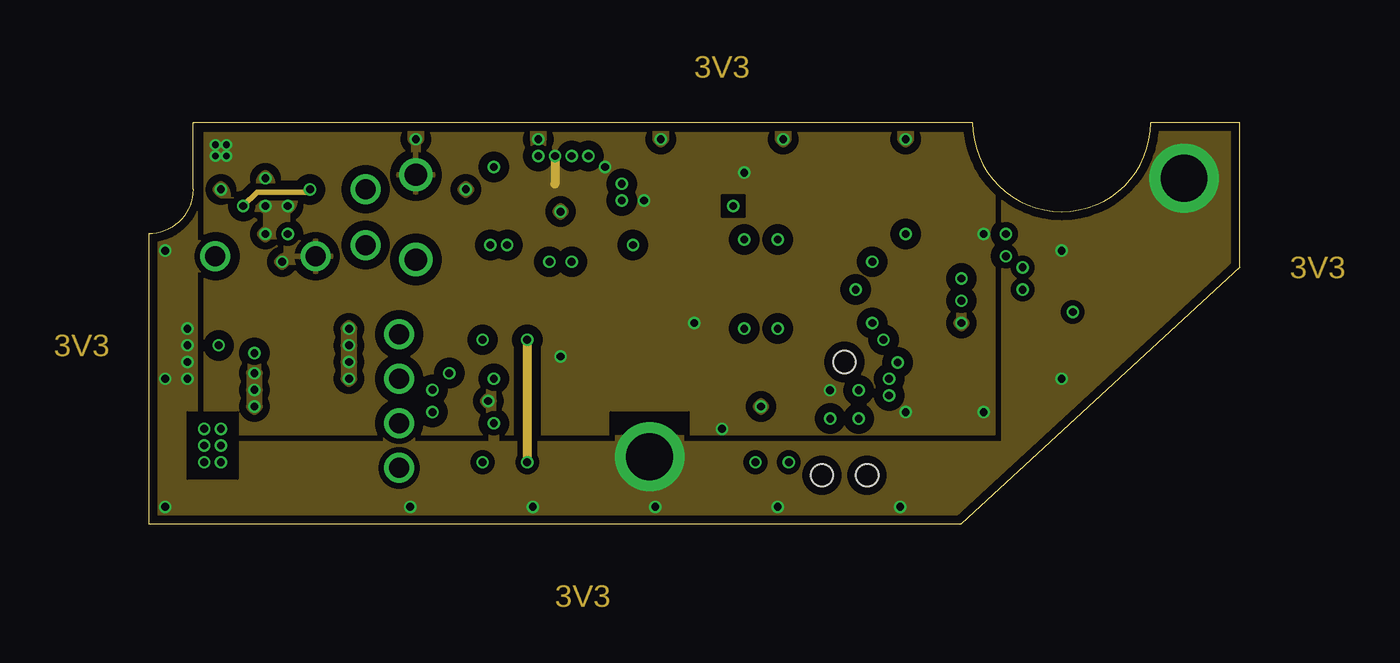
[diagram p11: board, inner layer Route2]
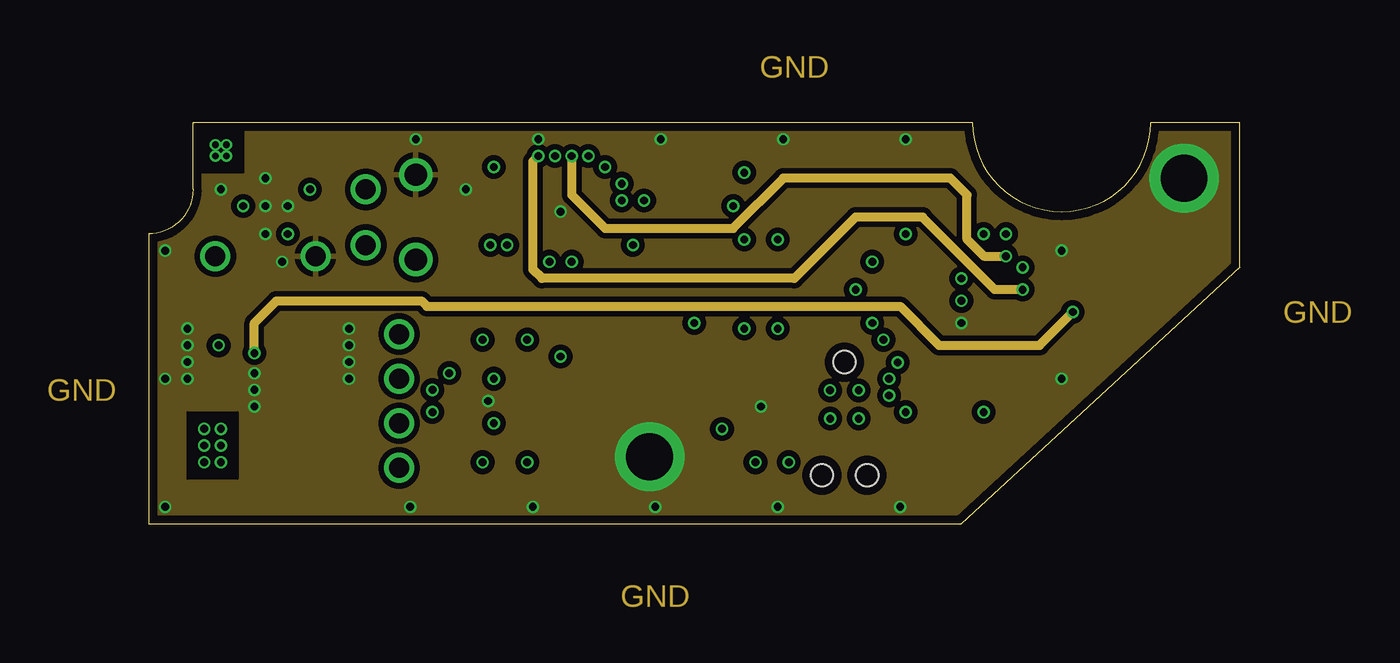
[diagram p12: board, inner layer Route3]
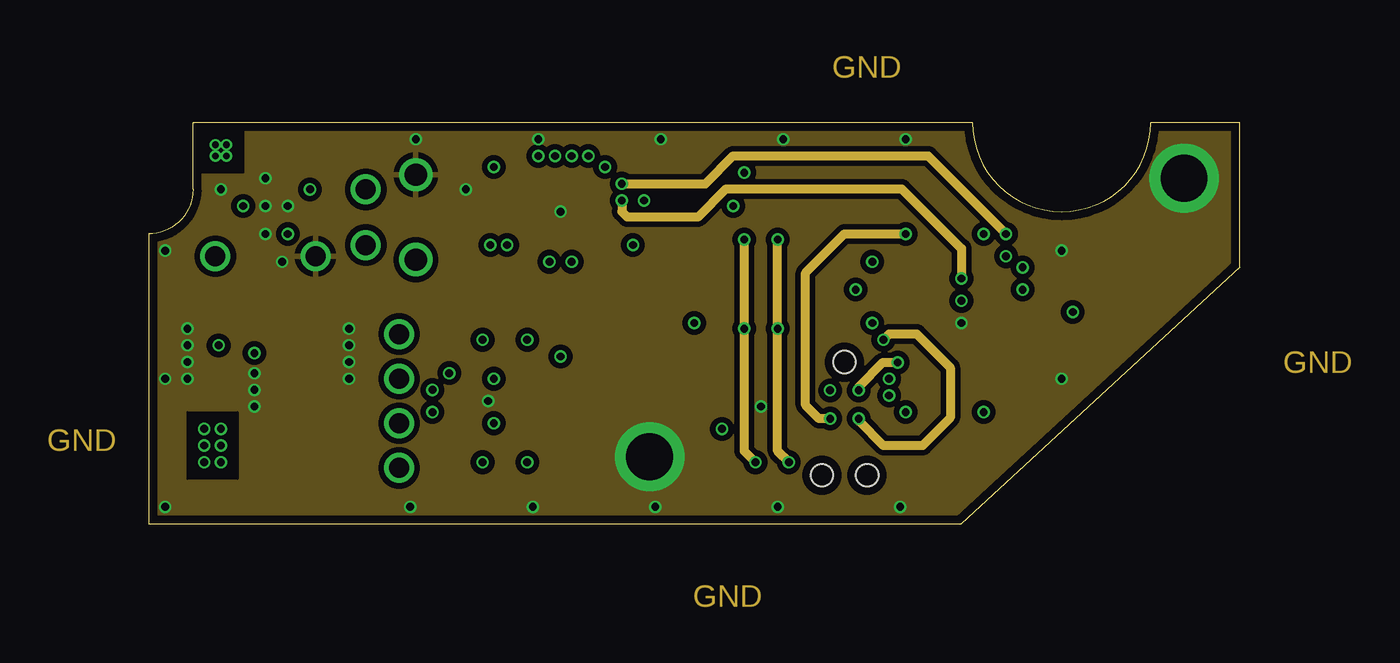
[diagram p13: board, inner layer Route14]
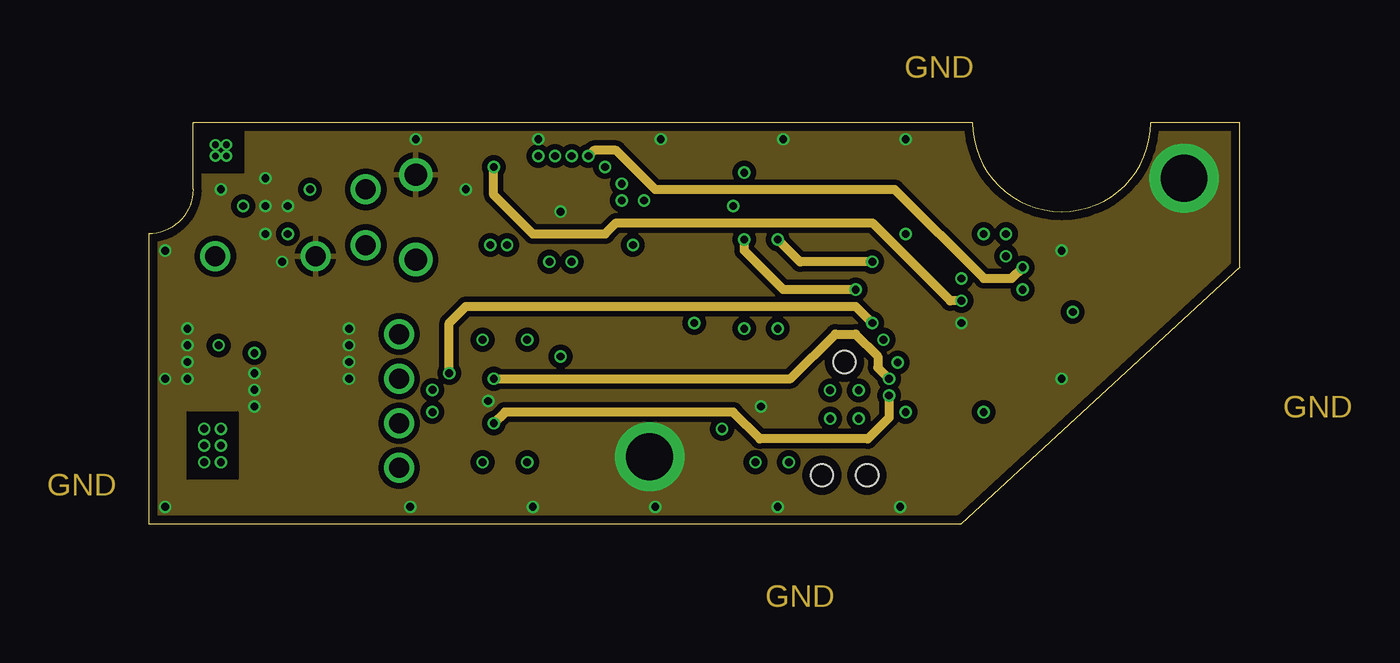
[diagram p14: board, inner layer Route15]
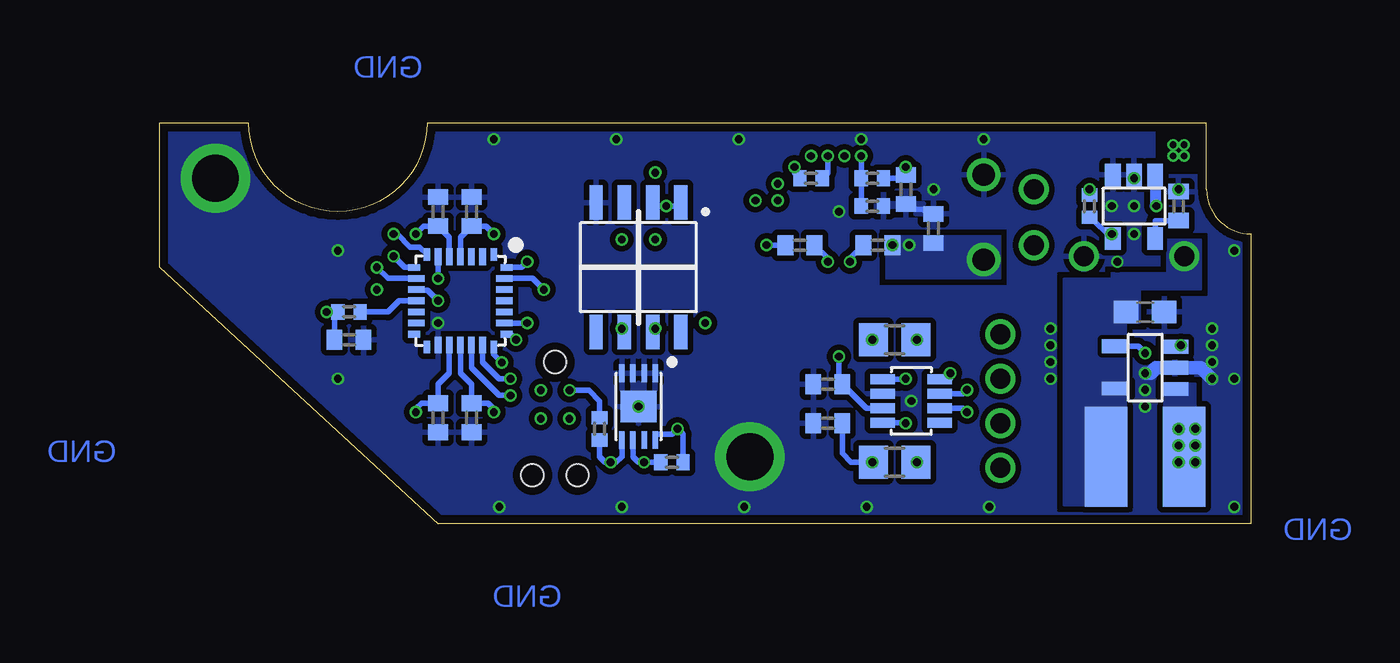
[diagram p15: board, bottom side, seen from below]

Size 49 x 18 mm. Coordinates in mm from the lower left corner, seen from the top.
Outline: 0,0 36.5,0 49,11.5 49,18 45,18 arc-180 37,18 2,18 2,15 arc-90 0,13 0,0
Copper layers (1*2*3*14*15*16): Top 0.0432mm / dielectric 0.1107mm / Route2 0.0175mm / dielectric 4mil / Route3 0.0175mm / dielectric 0.925575mm / Route14 0.0175mm / dielectric 4mil / Route15 0.0175mm / dielectric 0.1107mm / Bottom 0.0432mm
Design rules "oshpark-6layer": minimum track width 5mil, minimum drill 8mil, track to track 5mil, track to pad 5mil, pad to pad 5mil, via to via 5mil, smd to smd 5mil, copper to edge 15mil, drill to drill 6mil, minimum pad ring 4mil, minimum via ring 4mil, stop-mask expansion 1.5mil, vias tented up to drill 0mil, thermal gap 10mil
tRestrict: 7 lines

### Footprints (pad centres in the part's own frame; a part is rotated, then mirrored left to right if it is on the bottom)
C0402 = smd 0.7 x 0.9: 1 -0.65,0; 2 0.65,0
C0603 = smd 1.1 x 1: 1 -0.85,0; 2 0.85,0
TH = drill 1: NEG -1.905,0; POS 1.905,0
SMB = smd 2.4 x 2.4: A 2.2,0; C -2.2,0
SOT-23-5L = smd 0.6 x 1.2: ADJ/NC -0.95,-1.15; EN -0.95,1.15; GND 0,1.15; IN 0.95,1.15; OUT 0.95,-1.15
SOT23-5 = smd 0.7 x 1: 1_VDD -0.95,-1.4; 2_GND 0,-1.4; 3_GND 0.95,-1.4; 4_DOUT 0.95,1.45; 5_CD -0.95,1.45
UFQFPN-28 = smd 0.55 x 0.3: 1_PB8 -2.08,1.5; 7_PA1 -2.08,-1.5; 15_PB1 2.08,-1.5; 21_PA13 2.08,1.5 | smd 0.75 x 0.3: 2_PF0 -1.98,1; 3_PF1 -1.98,0.5; 4_NRST -1.98,0; 5_VDDA -1.98,-0.5; 6_PA0 -1.98,-1; 16_VSS 1.98,-1; 17_VDD 1.98,-0.5; 18_VDDIO2 1.98,0; 19_PA9-[PA11] 1.98,0.5; 20_PA10-[PA12] 1.98,1 | smd 0.3 x 0.55: 8_PA2 -1.5,-2.08; 14_PB0 1.5,-2.08; 22_PA14 1.5,2.08; 28_PB7 -1.5,2.08 | smd 0.3 x 0.75: 9_PA3 -1,-1.98; 10_PA4 -0.5,-1.98; 11_PA5 0,-1.98; 12_PA6 0.5,-1.98; 13_PA7 1,-1.98; 23_PA15 1,1.98; 24_PB3 0.5,1.98; 25_PB4 0,1.98; 26_PB5 -0.5,1.98; 27_PB6 -1,1.98
SOT23-8 = smd 0.45 x 1.1: P$1 -0.975,-1.275; P$2 -0.325,-1.275; P$3 0.325,-1.275; P$4 0.975,-1.275; P$5 0.975,1.275; P$6 0.325,1.275; P$7 -0.325,1.275; P$8 -0.975,1.275
SOT-23-3 = smd 0.56 x 0.95: 1 -0.95,-0.95; 2 0.95,-0.95; 3 0,0.95
SMD = smd 0.5 x 0.3: SCL -0.7,-0.4; SDA -0.7,0.4; VDD 0.7,-0.4; VSS 0.7,0.4
SON-8 = smd 0.25 x 0.8: P$1 -0.75,-1.5; P$2 -0.25,-1.5; P$3 0.25,-1.5; P$4 0.75,-1.5; P$5 0.75,1.5; P$6 0.25,1.5; P$7 -0.25,1.5; P$8 -0.75,1.5 | smd 1.6 x 1.4: P$9 0,0
SOIC8 = smd 0.6 x 1.55: P$1 -1.905,-2.91; P$2 -0.635,-2.91; P$3 0.635,-2.91; P$4 1.905,-2.91; P$5 1.905,2.91; P$6 0.635,2.91; P$7 -0.635,2.91; P$8 -1.905,2.91
TSOT-23-5 = smd 0.62 x 1.22: !SHDN! 0.96,1.33; FB 0.94,-1.33; GND -0.01,-1.33; SW -0.96,-1.33; VIN -0.94,1.33
VQFN16 = smd 0.6 x 0.24: P$1 -1.4,0.75; P$2 -1.4,0.25; P$3 -1.4,-0.25; P$4 -1.4,-0.75; P$9 1.4,-0.75; P$10 1.4,-0.25; P$11 1.4,0.25; P$12 1.4,0.75 | smd 0.24 x 0.6: P$5 -0.75,-1.4; P$6 -0.25,-1.4; P$7 0.25,-1.4; P$8 0.75,-1.4; P$13 0.75,1.4; P$14 0.25,1.4; P$15 -0.25,1.4; P$16 -0.75,1.4 | smd 1.6 x 1.6: P$17 0,0
5050 = smd 4.5 x 1.9: P$1 0,1.75; P$2 0,-1.75
R0402 = smd 0.6 x 0.7: 1 -0.5,0; 2 0.5,0
R0805 = smd 1.3 x 1.5: 1 -0.95,0; 2 0.95,0
R0603 = smd 1 x 1.1: 1 -0.85,0; 2 0.85,0
SJ = smd 1.168 x 1.6: 1 -0.762,0; 2 0.762,0
TC2030-NL = smd 0.787 x 0.787: 1_TVCC 1.27,-0.635; 2_T_SWDIO 1.27,0.635; 3_T_NRST 2.54,-0.635; 4_T_SWCLK 2.54,0.635; 5_GND 3.81,-0.635; 6_T_SWO 3.81,0.635 | hole 0.991: 0,0; 5.08,-1.016; 5.08,1.016
TH-0.9 = drill 0.9: P$1 0,0

### Placement (x,y rotation side)
C201  1uF / 10V  [C0402]  5.25,11.75 0 top
C203  1uF / 10V  [C0402]  5.25,16.75 180 top
C204  1uF / 10V  [C0402]  3.25,14.25 90 bottom
C301  0.1uF / 100V  [C0402]  36.5,4.75 90 bottom
C304  1uF / 10V  [C0402]  36.5,14 270 bottom
C305  0.1uF / 100V  [C0402]  35,4.75 90 bottom
C307  0.1uF / 100V  [C0402]  35,14 270 bottom
C402  47nF / 10V  [C0402]  19,4.5 180 bottom
C405  0.1uF / 100V  [C0402]  19,6.25 180 bottom
C501  0.1uF / 100V  [C0402]  27.5,9.75 0 top
C701  1uF / 10V  [C0402]  28.25,15.75 0 top
C702  10uF / 35V  [C0603]  28.25,14.25 0 top
C801  10uF / 35V  [C0603]  7.25,6.5 0 top
C802  4.7uF / 50V  [C0603]  4.75,9.5 180 bottom
C803  68pF / 50V  [C0402]  4,10.5 180 top
C804  10uF / 35V  [C0603]  7.25,8.75 0 top
C805  0.22uF / 50V  [C0402]  40.5,8.25 0 bottom
C901  22nF / 50V  [C0402]  20.25,12.5 180 bottom
C902  0.1uF / 100V  [C0402]  16.75,12.5 0 bottom
C903  0.1uF / 100V  [C0402]  14.25,13.25 270 bottom
C904  0.1uF / 100V  [C0402]  15.5,15 270 bottom
C906  100uF / 25V  [TH]  12,13.75 270 top
D801  MBRM120LT3G  [SMB]  4.75,3.5 180 top
IC201  LDK320AM33R  [SOT-23-5L]  5.25,14.25 180 top
IC203  R3119N058A-TR-FE  [SOT23-5]  5.25,14.25 180 bottom
IC302  STM32F042G6U6  [UFQFPN-28]  35.5,10 270 bottom
IC401  TCAN334  [SOT23-8]  15.25,5.5 270 bottom
IC402  SZNUP2105LT1G  [SOT-23-3]  13.25,5.5 270 top
IC501  SHT40-AD1F-R2  [SMD]  27.5,11.5 270 top
IC601  MB85RC16PN-G-AMERE1  [SON-8]  27.5,5.25 180 bottom
IC701  AS5601-ASOM  [SOIC8]  27.5,11.5 180 bottom
IC801  LT1935ES5#TRMPBF  [TSOT-23-5]  4.75,7 90 bottom
IC901  DRV8876RGTR  [VQFN16]  18.5,14 270 top
L801  CDRH4D18NP-4R7NC  [5050]  4.75,3 90 bottom
R1  26,2.75 0 bottom
R2  29.25,4.25 90 bottom
R201  100k  [R0402]  7.25,14.25 270 bottom
R402  60R, 0.5W  [R0805]  16,2.75 180 bottom
R403  60R, 0.5W  [R0805]  16,8.25 0 bottom
R801  10k  [R0402]  4,6.75 180 top
R802  85.6k  [R0603]  4,8.75 0 top
R803  10k  [R0402]  40.5,9.5 0 bottom
R901  foo  [R0402]  15.5,15 0 top
R903  10k  [R0402]  19.75,15.5 180 bottom
R905  2.2k  [R0402]  17,15.5 180 bottom
R906  1k  [R0402]  17,14.25 180 bottom
SJ401  CAN H term.  [SJ]  14.25,8.25 0 top
SJ402  CAN L term.  [SJ]  14.25,2.75 0 top
SWD1  31.25,7.25 270 top
TP1  3,12 180 top
TP2  7.5,12 180 top
TP3  11.25,6.5 90 top
TP4  11.25,8.5 90 top
TP5  11.25,2.5 90 top
TP6  11.25,4.5 90 top
TP7  9.75,15 0 top
TP8  9.75,12.5 0 top

### Tracks (layer width: path | path; a pad name or v marks a point on that pad's centre or on a via)
3V3  (via drill 0.3, 0.35)
  Top 0.25: v26.75,15.75 C701.1 27.6,14.25 C702.1 v26.25,14.25 | v24.5,9 25.25,9.75 C501.1 27.1,10 IC501.VDD | IC901.P$3 v18.25,16.5 | SWD1.1_TVCC v30.6,5.98 | IC901.P$14 21.5,13.75 v22.25,14.5
  Route2 0.406: v18.25,16.5 18.25,15.25
  Bottom 0.25: IC302.5_VDDA 36,12.85 C304.2 37.15,13.35 v37.5,13 | IC302.18_VDDIO2 35.5,6.75 35,6.25 C305.2 34.25,5.4 34,5.15 v34,5 | IC302.17_VDD 36,6.75 36.5,6.25 C301.2 37.25,5.4 37.5,5.15 v37.5,5 | IC601.P$8 26.75,4 26,4 v25.75,4.25 25.5,4 R1.2 | IC701.P$1 25.75,14.25 v26.25,14.25 26.7,14.25 IC701.P$2 | R903.2 20.5,15.75 v20.5,16 | v18.5,7.5 18.5,6.4 C405.1 17.27,5.17 IC401.P$3 | R2.2 29.25,5.5 29.73,5.98 v30.6,5.98
  other vias: 3.5,17 3,17 3,16.5 3.5,16.5
  pour Top (no thermals): 4.62,14.88 4.62,17.25 2.75,17.25 2.75,16.25 4,16.25 4,14.88
  pour Route2 (isolate 0.406, rank 3): 2.5,4 38,4 38,17.75 2.5,17.75
12V  (via drill 0.35)
  other vias: 16.1,12.5 15.35,12.5
  pour Top (no thermals): 8.25,2.25 8.25,4.75 7,4.75 7,11 4.25,11 4.25,8.25 5.75,8.25 5.75,2.25
  pour Top (no thermals): 15,12.85 15,12.12 16.5,12.12 16.5,12.35 17.75,12.35 17.75,12.85
  pour Bottom (no thermals): 11.25,12.9 16.4,12.9 16.4,11 11.25,11
  pour Top (no thermals): 11.25,12.75 12.75,12.75 12.75,9.5 6.75,9.5 6.75,11 11.25,11
12V0:!SHDN!_IN  (via drill 0.35)
  Route3 0.4: v4.75,7.65 4.75,9 5.75,10 12.25,10 12.5,9.75 33.75,9.75 35.5,8 40,8 v41.5,9.5
  Bottom 0.25: v4.75,7.65 5.06,7.96 IC801.!SHDN! | v41.5,9.5 R803.1 41.15,9.35 C805.1
12V0:FB  (via drill 0.35)
  Bottom 0.25: IC801.FB 3.36,8 v3.15,8
  pour Top (no thermals): 3.75,6 3.75,11 2.5,11 2.5,6
12V0:SW  (via drill 0.35)
  Top 0.5: D801.A v2.5,3.5
  other vias: 3.25,2.75 3.25,3.5 3.25,4.25 2.5,4.25 2.5,2.75
  pour Bottom (no thermals): 3.9,1.06 3.9,6.3 2.5,6.3 2.5,1.06
12V0_!SHDN!
  Bottom 0.25: IC302.11_PA5 38.25,10 38.75,9.5 R803.2
!STBY!  (via drill 0.35)
  Route15 0.4: v13.5,6.75 13.5,9 14.25,9.75 31.75,9.75 v32.5,9
  Bottom 0.25: IC401.P$8 13.95,6.5 13.5,6.5 v13.5,6.75 | IC302.23_PA15 v32.5,9
BAT+  (via drill 0.35)
  Route2 0.25: v7.25,15 7.12,14.88 4.87,14.88 v4.25,14.26 v4.25,14.25
  Bottom 0.5: IC203.1_VDD 4.3,14.25 v4.25,14.25 | R201.1 v7.25,15
  pour Bottom (no thermals): 8.39,0.8 8.39,11 5,11 5,9 5.62,9 5.62,0.8
  pour Top (no thermals): 4.88,11.35 2.25,11.35 2.25,14.47 4.55,14.47 4.55,12.25 4.88,12.25
  pour Bottom (no thermals): 2.25,12.75 2.25,10.5 5,10.5 5,9.75 6.25,9.75 6.25,11.25 3.75,11.25 3.75,12.75
CAN_H  (via drill 0.35)
  Top 0.25: IC402.1 12.25,6.5 | SJ401.1 13.49,7.64 IC402.1 | IC402.1 12.75,6.45 v12.75,6
  Top 0.5: TP4.P$1 TP3.P$1 12.25,6.5
  Bottom 0.25: IC401.P$7 12.93,5.83 v12.75,6
CAN_INFRA:H  (via drill 0.35)
  Top 0.25: SJ401.2 v15,8.25
  Bottom 0.25: R403.2 v15,8.25
CAN_INFRA:L  (via drill 0.35)
  Top 0.25: SJ402.2 v15,2.75
  Bottom 0.25: R402.1 v15,2.75
CAN_INFRA:SPLIT  (via drill 0.35)
  Route2 0.4: v17,8.25 v17,2.75
  Bottom 0.25: C402.1 18.35,3.15 17.95,2.75 R402.2 v17,2.75 | R403.1 v17,8.25
CAN_L  (via drill 0.35)
  Top 0.25: 11.3,4.55 TP6.P$1 | v12.75,5 12.75,4.55 IC402.2 13.49,3.36 SJ402.1
  Top 0.5: TP5.P$1 TP6.P$1 | IC402.2 11.3,4.55
  Bottom 0.25: IC401.P$6 12.93,5.17 v12.75,5
CAN_RX  (via drill 0.35)
  Route15 0.4: v33.25,5.75 33.25,4.75 32.3,3.8 27.45,3.8 26.25,5 16,5 v15.5,4.5
  Bottom 0.25: IC302.19_PA9-[PA11] 35,7 33.75,5.75 v33.25,5.75 | v15.5,4.5 15.53,4.53 IC401.P$4
CAN_TX  (via drill 0.35)
  Route15 0.4: v15.5,6.5 28.83,6.5 30.83,8.5 31.75,8.5 32.75,7.5 32.75,7 v33.25,6.5
  Bottom 0.25: IC302.20_PA10-[PA12] 34.5,7.25 33.75,6.5 v33.25,6.5 | IC401.P$1 15.53,6.47 v15.5,6.5
EX
  cutout Route2: 1.75,2 1.75,2.25 1.75,5 4,5 4,2
  cutout Route15: 2.25,15.75 2.25,17.75 4.25,17.75 4.25,15.75
  cutout Route2: 25.75,14.75 26.75,14.75 26.75,13.75 25.75,13.75
  cutout Route2 (no thermals): 20.75,5 24.25,5 24.25,4 20.75,4
  cutout Route3: 1.75,2 1.75,2.25 1.75,5 4,5 4,2
  cutout Route14: 1.75,2 1.75,2.25 1.75,5 4,5 4,2
  cutout Route14: 2.25,15.75 2.25,17.75 4.25,17.75 4.25,15.75
  cutout Route3: 2.25,15.75 2.25,17.75 4.25,17.75 4.25,15.75
  cutout Bottom: 2.25,15.75 2.25,17.75 4.25,17.75 4.25,15.75
  cutout Route15: 1.75,2 1.75,2.25 1.75,5 4,5 4,2
GND  (via drill 0.35, 2.1)
  Top 0.25: C201.2 5.25,12.4 v5.25,13 | v5.25,15.5 5.25,16.1 C203.1 | 15.75,13.75 IC901.P$7 18.25,13.75 IC901.P$17 19.25,13.25 IC901.P$13 21.5,13.25
  Bottom 0.25: C903.1 14.5,13.9 14.7,14.1 15.25,14.1 C904.2
  Bottom 0.61: v1.75,6.5 2.24,6.99 IC801.GND 4.26,6.99 R801.1 v4.75,6.75
  other vias: 22.5,3 46.5,15.5 4.75,6 4.75,5.25 9,8.75 9,6.5 18.5,14 5.25,14.25 6,11.75 3.25,15 6.25,14.25 9,7.25 9,8 1.75,7.25 1.75,8 1.75,8.75 27.5,5.25 15.25,5.5 36.5,9 0.75,12.25 0.75,0.75 0.75,6.5 41,6.5 33.75,0.75 34,17.25 14.25,15 17.5,17.25 17.25,0.75 11.75,0.75 23,17.25 12,17.25 41,12.25 22.75,0.75 28.25,0.75 28.5,17.25
  pour Top (isolate 0.254, rank 6): -0.25,-0.25 49.25,-0.25 49.25,18.25 -0.25,18.25
  pour Route15 (isolate 0.254, rank 6): -0.25,-0.25 49.25,-0.25 49.25,18.25 -0.25,18.25
  pour Bottom (isolate 0.254, rank 6): -0.25,-0.25 49.25,-0.25 49.25,18.25 -0.25,18.25
  pour Route3 (isolate 0.254, rank 6): -0.25,18.25 49.25,18.25 49.25,-0.25 -0.25,-0.25
  pour Route14 (isolate 0.254): -0.25,18.25 49.25,18.25 49.25,-0.25 -0.25,-0.25
  pour Route2 (isolate 0.254, rank 6): -0.25,18.25 49.25,18.25 49.25,-0.25 -0.25,-0.25
I2C_SCL  (via drill 0.35)
  Top 0.25: IC501.SCL 27.1,12.4 v26.75,12.75
  Route14 0.4: v27.25,2.75 26.75,3.25 v26.75,8.75 v26.75,12.75
  Route15 0.4: v31.75,10.5 28.5,10.5 26.75,12.25 v26.75,12.75
  Bottom 0.25: IC601.P$6 27.75,3 27.5,2.75 v27.25,2.75 R1.1 | IC302.27_PB6 32.25,11 v31.75,10.5 | IC701.P$7 26.75,8.71 v26.75,8.75
I2C_SDA  (via drill 0.35)
  Top 0.25: IC501.SDA 27.9,12.4 v28.25,12.75
  Route14 0.4: v28.75,2.75 28.25,3.25 v28.25,8.75 v28.25,12.75
  Route15 0.4: v32.5,11.75 29.25,11.75 v28.25,12.75
  Bottom 0.25: IC601.P$5 28.25,3 28.5,2.75 v28.75,2.75 29,2.75 29.25,3 R2.1 | IC302.28_PB7 32.75,11.5 v32.5,11.75 | IC701.P$6 28.14,8.63 v28.25,8.75
MC:CPH  (via drill 0.35)
  Top 0.25: IC901.P$11 18.75,12 v19,11.75
  Bottom 0.25: v19,11.75 19,11.9 C901.1
MC:CPL  (via drill 0.35)
  Top 0.25: IC901.P$12 21.65,12.6 v21.75,12.5
  Bottom 0.25: v21.75,12.5 C901.2
MC:IMODE
  Top 0.25: IC901.P$5 16.25,14.75 R901.2
MC:IPROPI  (via drill 0.35)
  Top 0.25: v17.5,16.5 17.5,16.25 17.75,16 IC901.P$4
  Route3 0.4: v39.25,10.5 38,10.5 34.75,13.75 31.75,13.75 29,11 17.66,11 17.25,11.41 17.25,16.25 v17.5,16.5
  Bottom 0.25: R906.2 R905.2 v17.5,16.5
MC:VCP  (via drill 0.35)
  Top 0.25: v18,11.75 18.25,12 IC901.P$10
  Bottom 0.25: v18,11.75 18,11.9 C902.1
MOTOR+
  Top 0.25: TP7.P$1 10.5,14.25 IC901.P$6
MOTOR-
  Top 0.25: TP8.P$1 10.5,13.25 IC901.P$8
MOTOR_FLT  (via drill 0.35)
  Top 0.25: v19,16.5 19,16.25 18.75,16 IC901.P$2
  Route3 0.4: v38.5,12 37.5,12 36.75,12.75 36.75,14.75 36,15.5 28.5,15.5 26.25,13.25 20.5,13.25 19,14.75 v19,16.5
  Bottom 0.25: v19,16.5 19,15.75 R903.1 | IC302.8_PA2 38,11.5 v38.5,12
MOTOR_IN1  (via drill 0.35)
  Top 0.25: v21.25,14.5 21,14.25 IC901.P$15
  Route14 0.4: v21.25,14.5 21.25,14 21.5,13.75 24.66,13.75 25.93,15.02 33.81,15.02 36.5,12.34 v36.5,11
  Bottom 0.25: v36.5,11 IC302.6_PA0
MOTOR_IN2  (via drill 0.35)
  Top 0.25: IC901.P$16 20.25,14.75 20.75,15.25 v21.25,15.25
  Route14 0.4: v21.25,15.25 25,15.25 26.25,16.5 35,16.5 v38.5,13
  Bottom 0.25: IC302.7_PA1 37.33,12.41 37.74,12.41 38.34,13 v38.5,13
MOTOR_IPROP  (via drill 0.35)
  Route15 0.4: v36.5,10 36,10 32.5,13.5 21,13.5 20.5,13 17.25,13 15.5,14.75 v15.5,16
  Bottom 0.25: v15.5,16 C904.1 15.5,15.5 R905.1 | IC302.10_PA4 37.45,10.46 36.97,10.46 v36.5,10
MOTOR_SLP  (via drill 0.35)
  Top 0.25: IC901.P$1 19.25,15.75 19.75,16.25 v19.75,16.5
  Route15 0.4: v19.75,16.5 20,16.75 21,16.75 22.75,15 33.5,15 37.5,11 38.75,11 v39.25,11.5
  Bottom 0.25: IC302.9_PA3 38.75,11 v39.25,11.5
POWER_3V3:CD
  Bottom 0.25: C204.1 4.3,13.6 IC203.5_CD
POWER_3V3:EN  (via drill 0.35)
  Top 0.25: IC201.EN 6.2,13 v6.25,13
  Bottom 0.25: v6.25,13 6.2,13 IC203.4_DOUT 6.25,12.8 7.2,13.75 R201.2
SYS_NRST  (via drill 0.35)
  Top 0.25: SWD1.3_T_NRST
  Route14 0.4: SWD1.3_T_NRST 30.11,4.71 29.5,5.32 29.5,11.25 31.25,13 v34,13
  Bottom 0.25: IC302.4_NRST 35.5,12.85 C307.2 34.35,13.35 v34,13
  other vias: 30.61,4.71
SYS_SWCLK  (via drill 0.35)
  Top 0.25: SWD1.4_T_SWCLK
  Route14 0.25: 31.89,4.61 SWD1.4_T_SWCLK
  Route14 0.4: v33,8.25 33.25,8.5 34.5,8.5 36,7 36,4.75 34.75,3.5 33,3.5 31.89,4.61
  Bottom 0.25: IC302.22_PA14 33.25,8.5 v33,8.25
  other vias: 31.89,4.71
SYS_SWDIO  (via drill 0.35)
  Top 0.25: SWD1.2_T_SWDIO
  Route14 0.25: SWD1.2_T_SWDIO 31.89,6.14
  Route14 0.4: 31.89,6.14 32.98,7.23 v33.63,7.23
  Bottom 0.25: IC302.21_PA13 34,7.59 v33.63,7.23
  other vias: 31.89,5.98

### Text on the board
Top: GND | GND | GND | GND
Route2: 3V3 | 3V3 | 3V3 | 3V3
Route3: GND | GND | GND | GND
Route14: GND | GND | GND | GND
Route15: GND | GND | GND | GND
Bottom: GND | GND | GND | GND
tPlace: - | Motor | + | H | L
tStop: MJ514 / ejovrh rev.1a